# Altium project Alhambra_II.PrjPcb
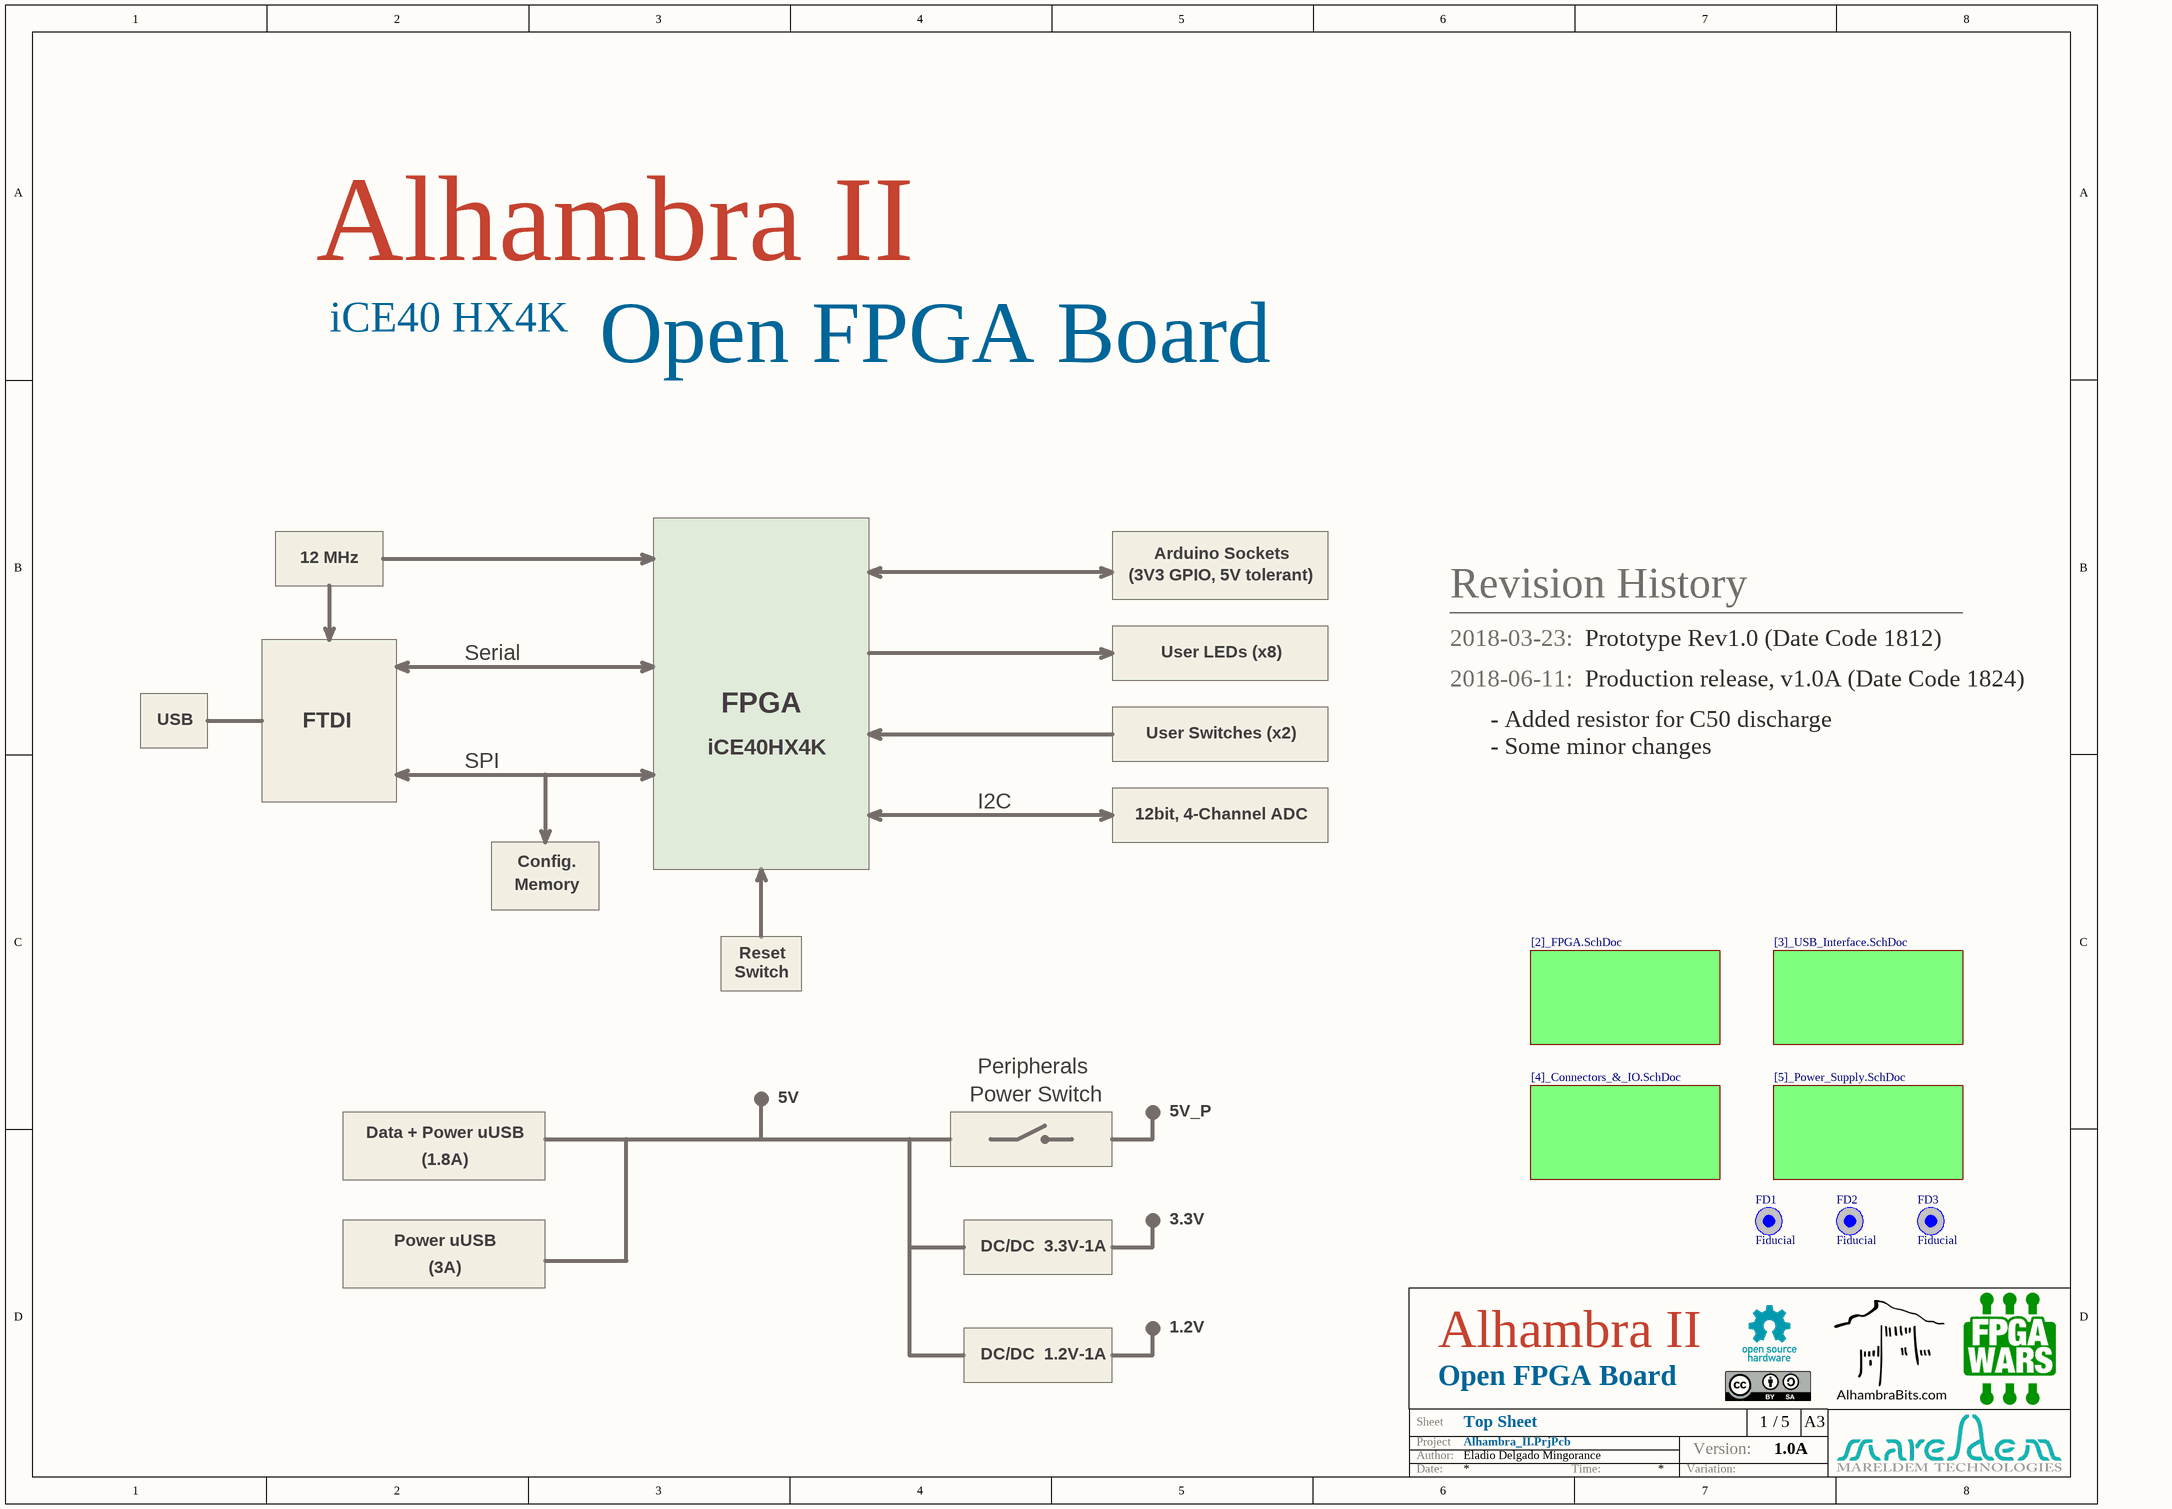
[diagram p0: [1]_Alhambra_II.SchDoc]
5 sheets, 158 parts. Net scope: flat (ports and power ports of the same name join across sheets).
Board file: Alhambra_II.PcbDoc
Sheets:
  [1]_Alhambra_II.SchDoc
    [2]_FPGA.SchDoc = [2]_FPGA.SchDoc
    [3]_USB_Interface.SchDoc = [3]_USB_Interface.SchDoc
    [4]_Connectors_&_IO.SchDoc = [4]_Connectors_&_IO.SchDoc
    [5]_Power_Supply.SchDoc = [5]_Power_Supply.SchDoc

## Sheet [1]_Alhambra_II.SchDoc: Top Sheet
size A3; Author: Eladio Delgado Mingorance; CompanyName: Mareldem Technologies; Organization: Mareldem Technologies; Revision: 1.0A; SheetNumber: 1; SheetTotal: 5

### Parts
FD1  Fiducial  [Fiducial_1mm]  (no BOM)
FD2  Fiducial  [Fiducial_1mm]  (no BOM)
FD3  Fiducial  [Fiducial_1mm]  (no BOM)

### Sub-sheets
[2]_FPGA.SchDoc = [2]_FPGA.SchDoc: no entries
[3]_USB_Interface.SchDoc = [3]_USB_Interface.SchDoc: no entries
[4]_Connectors_&_IO.SchDoc = [4]_Connectors_&_IO.SchDoc: no entries
[5]_Power_Supply.SchDoc = [5]_Power_Supply.SchDoc: no entries

### Notes on the sheet
- Alhambra II
- iCE40 HX4K
- Open FPGA Board
- 12 MHz
- (3V3 GPIO, 5V tolerant)
- Arduino Sockets
- Revision History
- 2018-03-23:
- Prototype Rev1.0 (Date Code 1812)
- Serial
- FPGA
- User LEDs (x8)
- 2018-06-11:
- Production release, v1.0A (Date Code 1824)
- USB
- FTDI
- SPI
- iCE40HX4K
- User Switches (x2)
- - Added resistor for C50 discharge
- - Some minor changes
- I2C
- 12bit, 4-Channel ADC
- Memory
- Config.
- Switch
- Reset
- 5V
- Power Switch
- Peripherals
- 5V_P
- Data + Power uUSB
- (1.8A)
- Power uUSB
- DC/DC  3.3V-1A
- 3.3V
- (3A)
- DC/DC  1.2V-1A
- 1.2V
- Project
- Sheet
- Author:
- Version:
- /
- A3
- Date:
- Time:
- Variation:

### Library data of the parts
FD1-FD3 = Fiducial 1mm: Fiducial Mark; Part Number: Fiducial 1mm

## Sheet [2]_FPGA.SchDoc: FPGA
size A3; Author: Eladio Delgado Mingorance; CompanyName: Mareldem Technologies; Organization: Mareldem Technologies; Revision: 1.0A; SheetNumber: 2; SheetTotal: 5
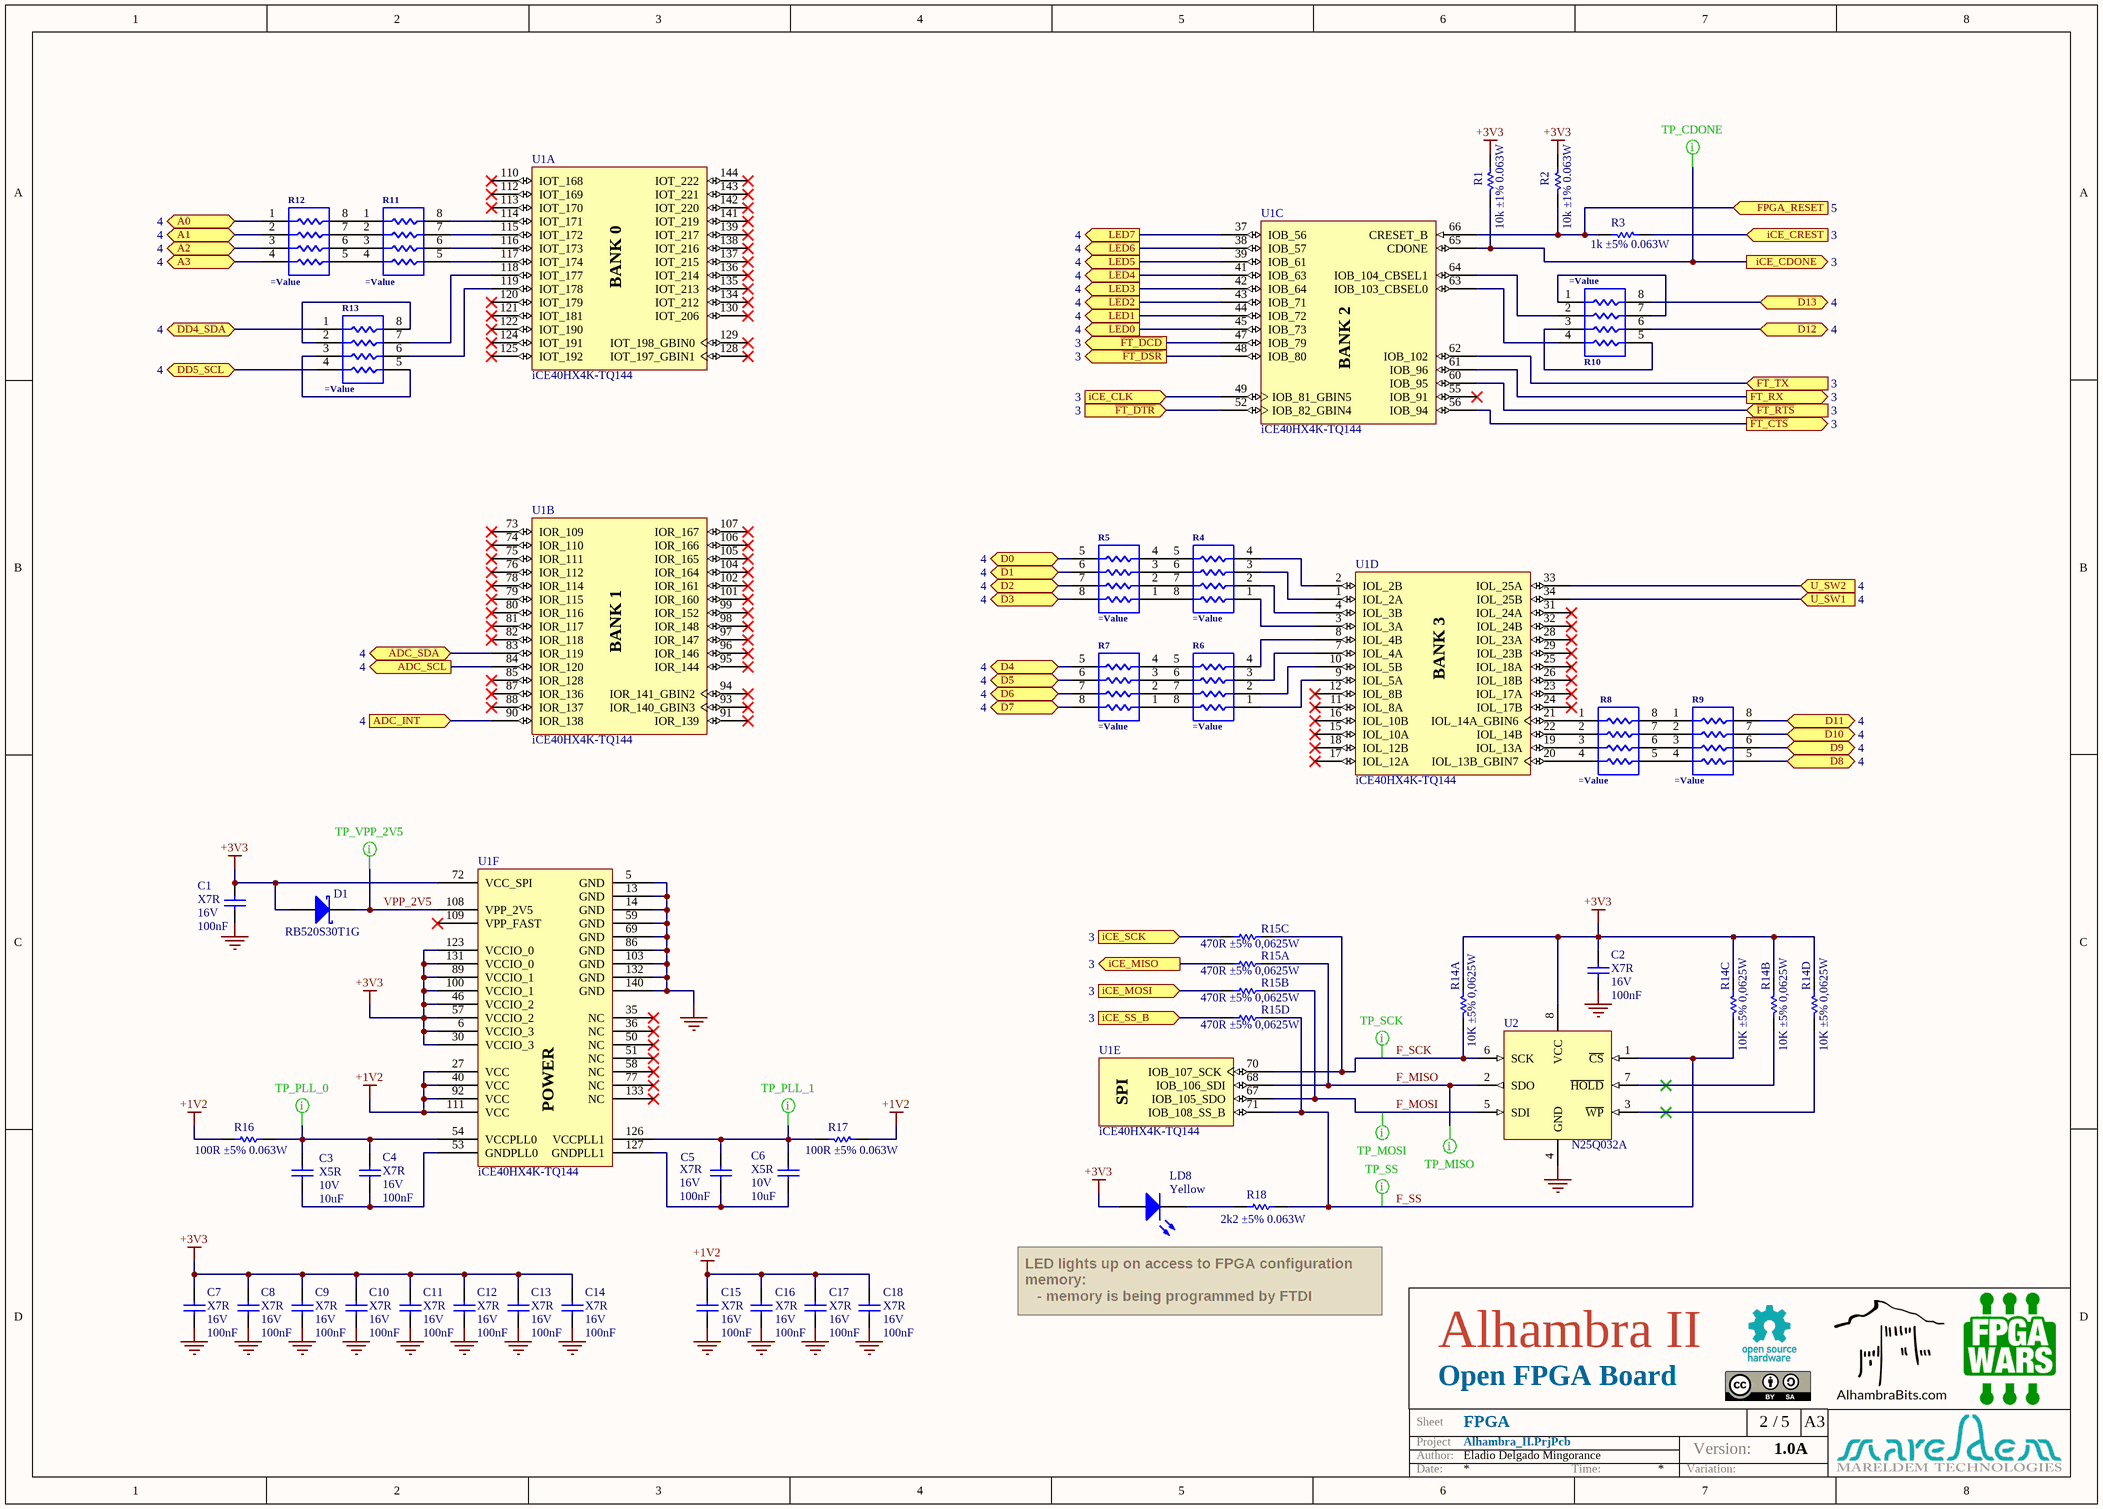
[diagram p1: [2]_FPGA.SchDoc]

### Parts
C1  Dielectric: X7R  Voltage: 16V  Capacitance: 100nF  [C0402]  (hidden comment: Capacitor)
C2  Dielectric: X7R  Voltage: 16V  Capacitance: 100nF  [C0402]  (hidden comment: Capacitor)
C3  Dielectric: X5R  Voltage: 10V  Capacitance: 10uF  [C0603]  (hidden comment: Capacitor)
C4  Dielectric: X7R  Voltage: 16V  Capacitance: 100nF  [C0402]  (hidden comment: Capacitor)
C5  Dielectric: X7R  Voltage: 16V  Capacitance: 100nF  [C0402]  (hidden comment: Capacitor)
C6  Dielectric: X5R  Voltage: 10V  Capacitance: 10uF  [C0603]  (hidden comment: Capacitor)
C7  Dielectric: X7R  Voltage: 16V  Capacitance: 100nF  [C0402]  (hidden comment: Capacitor)
C8  Dielectric: X7R  Voltage: 16V  Capacitance: 100nF  [C0402]  (hidden comment: Capacitor)
C9  Dielectric: X7R  Voltage: 16V  Capacitance: 100nF  [C0402]  (hidden comment: Capacitor)
C10  Dielectric: X7R  Voltage: 16V  Capacitance: 100nF  [C0402]  (hidden comment: Capacitor)
C11  Dielectric: X7R  Voltage: 16V  Capacitance: 100nF  [C0402]  (hidden comment: Capacitor)
C12  Dielectric: X7R  Voltage: 16V  Capacitance: 100nF  [C0402]  (hidden comment: Capacitor)
C13  Dielectric: X7R  Voltage: 16V  Capacitance: 100nF  [C0402]  (hidden comment: Capacitor)
C14  Dielectric: X7R  Voltage: 16V  Capacitance: 100nF  [C0402]  (hidden comment: Capacitor)
C15  Dielectric: X7R  Voltage: 16V  Capacitance: 100nF  [C0402]  (hidden comment: Capacitor)
C16  Dielectric: X7R  Voltage: 16V  Capacitance: 100nF  [C0402]  (hidden comment: Capacitor)
C17  Dielectric: X7R  Voltage: 16V  Capacitance: 100nF  [C0402]  (hidden comment: Capacitor)
C18  Dielectric: X7R  Voltage: 16V  Capacitance: 100nF  [C0402]  (hidden comment: Capacitor)
D1  RB520S30T1G  [SOD523]
LD8  Yellow  [LED0603]
R1  value 10k ±1% 0.063W  [R0402]  (hidden comment: Resistor)
R2  value 10k ±1% 0.063W  [R0402]  (hidden comment: Resistor)
R3  value 1k ±5% 0.063W  [R0402]  (hidden comment: Resistor)
R4  (no value)  [4xArray_1206_Convex]
R5  (no value)  [4xArray_1206_Convex]
R6  (no value)  [4xArray_1206_Convex]
R7  (no value)  [4xArray_1206_Convex]
R8  (no value)  [4xArray_1206_Convex]
R9  (no value)  [4xArray_1206_Convex]
R10  (no value)  [4xArray_1206_Convex]
R11  (no value)  [4xArray_1206_Convex]
R12  (no value)  [4xArray_1206_Convex]
R13  (no value)  [4xArray_1206_Convex]
R14  value 10K ±5% 0,0625W  [4xArray_1206_Convex]  (hidden comment: Resistor_x4_Parts)  (parts A,B,C,D of 4)
R15  value 470R ±5% 0,0625W  [4xArray_1206_Convex]  (hidden comment: Resistor_x4_Parts)  (parts A,B,C,D of 4)
R16  value 100R ±5% 0.063W  [R0402]  (hidden comment: Resistor)
R17  value 100R ±5% 0.063W  [R0402]  (hidden comment: Resistor)
R18  value 2k2 ±5% 0.063W  [R0402]  (hidden comment: Resistor)
U1  iCE40HX4K-TQ144  [TQFP-144_HX4K_FPGAwars]  (parts A,B,C,D,E,F of 6)
U2  N25Q032A  [DFN-8 6x5mm]

### Ports
A0 (bidir, see 4), A1 (bidir, see 4), A2 (bidir, see 4), A3 (bidir, see 4), ADC_INT (in, see 4), ADC_SCL (out, see 4), ADC_SDA (bidir, see 4), D0 (bidir, see 4), D1 (bidir, see 4), D2 (bidir, see 4), D3 (bidir, see 4), D4 (bidir, see 4), D5 (bidir, see 4), D6 (bidir, see 4), D7 (bidir, see 4), D8 (bidir, see 4), D9 (bidir, see 4), D10 (bidir, see 4), D11 (bidir, see 4), D12 (bidir, see 4), D13 (bidir, see 4), DD4_SDA (bidir, see 4), DD5_SCL (bidir, see 4), FPGA_RESET (in, see 5), FT_RX (out, see 3), FT_TX (in, see 3), iCE_CDONE (out, see 3), iCE_CLK (in, see 3), iCE_CREST (in, see 3), iCE_MISO (out, see 3), iCE_MOSI (in, see 3), iCE_SCK (in, see 3), iCE_SS_B (in, see 3), LED0 (out, see 4), LED1 (out, see 4), LED2 (out, see 4), LED3 (out, see 4), LED4 (out, see 4), LED5 (out, see 4), LED6 (out, see 4), LED7 (out, see 4), U_SW1 (in, see 4), U_SW2 (in, see 4), ~{FT_CTS} (out, see 3), ~{FT_DCD} (out, see 3), ~{FT_DSR} (out, see 3), ~{FT_DTR} (in, see 3), ~{FT_RTS} (in, see 3)

### Nets
+1V2: C15.2 C16.2 C17.2 C18.2 R16.2 R17.2 U1.27(VCC) U1.40(VCC) U1.92(VCC) U1.111(VCC)
+3V3: C1.2 C2.1 C7.2 C8.2 C9.2 C10.2 C11.2 C12.2 C13.2 C14.2 D1.A LD8.A R1.1 R2.1 R14.1 R14.2 R14.3 R14.4 U1.6(VCCIO_3) U1.30(VCCIO_3) U1.46(VCCIO_2) U1.57(VCCIO_2) U1.72(VCC_SPI) U1.89(VCCIO_1) U1.100(VCCIO_1) U1.123(VCCIO_0) U1.131(VCCIO_0) U2.8(VCC)
GND: C1.1 C2.2 C7.1 C8.1 C9.1 C10.1 C11.1 C12.1 C13.1 C14.1 C15.1 C16.1 C17.1 C18.1 U1.5(GND) U1.13(GND) U1.14(GND) U1.59(GND) U1.69(GND) U1.86(GND) U1.103(GND) U1.132(GND) U1.140(GND) U2.4(GND)
A0: R12.1 ; port A0
A1: R12.2 ; port A1
A2: R12.3 ; port A2
A3: R12.4 ; port A3
D0: R5.5 ; port D0
D1: R5.6 ; port D1
D2: R5.7 ; port D2
D3: R5.8 ; port D3
D4: R7.5 ; port D4
D5: R7.6 ; port D5
D6: R7.7 ; port D6
D7: R7.8 ; port D7
D8: R9.5 ; port D8
D9: R9.6 ; port D9
D10: R9.7 ; port D10
D11: R9.8 ; port D11
D12: R10.6 ; port D12
D13: R10.8 ; port D13
DD4_SDA: R13.1 ; port DD4_SDA
DD5_SCL: R13.4 ; port DD5_SCL
F_MISO: R15.8 U1.68(IOB_106_SDI) U2.2(SDO)
F_MOSI: R15.7 U1.67(IOB_105_SDO) U2.5(SDI)
F_SCK: R14.8 R15.6 U1.70(IOB_107_SCK) U2.6(SCK)
F_SS: R14.6 R15.5 R18.2 U1.71(IOB_108_SS_B) U2.1(~{CS})
VPP_2V5: D1.k(K) U1.108(VPP_2V5)
NetC3_1: C3.1 C4.2 R16.1 U1.54(VCCPLL0)
NetC3_2: C3.2 C4.1 U1.53(GNDPLL0)
NetC5_1: C5.1 C6.1 U1.127(GNDPLL1)
NetC5_2: C5.2 C6.2 R17.1 U1.126(VCCPLL1)
NetC38_2: U1.34(IOL_25B) ; port U_SW1
NetC39_2: U1.33(IOL_25A) ; port U_SW2
NetD5_A: R2.2 R3.2 U1.66(CRESET_B) ; port FPGA_RESET
NetLD8_K: LD8.K R18.1
NetR1_2: R1.2 U1.65(CDONE) ; port iCE_CDONE
NetR3_1: R3.1 ; port iCE_CREST
NetR4_1: R4.1 U1.3(IOL_3A)
NetR4_2: R4.2 U1.4(IOL_3B)
NetR4_3: R4.3 U1.1(IOL_2A)
NetR4_4: R4.4 U1.2(IOL_2B)
NetR4_5: R4.5 R5.4
NetR4_6: R4.6 R5.3
NetR4_7: R4.7 R5.2
NetR4_8: R4.8 R5.1
NetR6_1: R6.1 U1.9(IOL_5A)
NetR6_2: R6.2 U1.10(IOL_5B)
NetR6_3: R6.3 U1.7(IOL_4A)
NetR6_4: R6.4 U1.8(IOL_4B)
NetR6_5: R6.5 R7.4
NetR6_6: R6.6 R7.3
NetR6_7: R6.7 R7.2
NetR6_8: R6.8 R7.1
NetR8_1: R8.1 U1.21(IOL_14A_GBIN6)
NetR8_2: R8.2 U1.22(IOL_14B)
NetR8_3: R8.3 U1.19(IOL_13A)
NetR8_4: R8.4 U1.20(IOL_13B_GBIN7)
NetR8_5: R8.5 R9.4
NetR8_6: R8.6 R9.3
NetR8_7: R8.7 R9.2
NetR8_8: R8.8 R9.1
NetR10_1: R10.1 R10.7
NetR10_2: R10.2 U1.64(IOB_104_CBSEL1)
NetR10_3: R10.3 R10.5
NetR10_4: R10.4 U1.63(IOB_103_CBSEL0)
NetR11_1: R11.1 R12.8
NetR11_2: R11.2 R12.7
NetR11_3: R11.3 R12.6
NetR11_4: R11.4 R12.5
NetR11_5: R11.5 U1.117(IOT_174)
NetR11_6: R11.6 U1.116(IOT_173)
NetR11_7: R11.7 U1.115(IOT_172)
NetR11_8: R11.8 U1.114(IOT_171)
NetR13_2: R13.2 R13.8
NetR13_3: R13.3 R13.5
NetR13_6: R13.6 U1.119(IOT_178)
NetR13_7: R13.7 U1.118(IOT_177)
NetR14_5: R14.5 U2.3(~{WP})
NetR14_7: R14.7 U2.7(~{HOLD})
NetR15_1: R15.1 ; port iCE_MISO
NetR15_2: R15.2 ; port iCE_MOSI
NetR15_3: R15.3 ; port iCE_SCK
NetR15_4: R15.4 ; port iCE_SS_B
NetR27_2: U1.49(IOB_81_GBIN5) ; port iCE_CLK
NetR28_1: U1.84(IOR_120) ; port ADC_SCL
NetR29_1: U1.83(IOR_119) ; port ADC_SDA
NetR34_1: U1.41(IOB_63) ; port LED4
NetR34_2: U1.39(IOB_61) ; port LED5
NetR34_3: U1.38(IOB_57) ; port LED6
NetR34_4: U1.37(IOB_56) ; port LED7
NetR35_1: U1.45(IOB_73) ; port LED0
NetR35_2: U1.44(IOB_72) ; port LED1
NetR35_3: U1.43(IOB_71) ; port LED2
NetR35_4: U1.42(IOB_64) ; port LED3
NetU1_47: U1.47(IOB_79) ; port ~{FT_DCD}
NetU1_48: U1.48(IOB_80) ; port ~{FT_DSR}
NetU1_52: U1.52(IOB_82_GBIN4) ; port ~{FT_DTR}
NetU1_56: U1.56(IOB_94) ; port ~{FT_CTS}
NetU1_60: U1.60(IOB_95) ; port ~{FT_RTS}
NetU1_61: U1.61(IOB_96) ; port FT_RX
NetU1_62: U1.62(IOB_102) ; port FT_TX
NetU1_90: U1.90(IOR_138) ; port ADC_INT

Not connected (* = marked no-connect by the designer): U1 11(IOL_8A)* 12(IOL_8B)* 15(IOL_10A)* 16(IOL_10B)* 17(IOL_12A)* 18(IOL_12B)* 23(IOL_17A)* 24(IOL_17B)* 25(IOL_18A)* 26(IOL_18B)* 28(IOL_23A)* 29(IOL_23B)* 31(IOL_24A)* 32(IOL_24B)* 35(NC)* 36(NC)* 50(NC)* 51(NC)* 55(IOB_91)* 58(NC)* 73(IOR_109)* 74(IOR_110)* 75(IOR_111)* 76(IOR_112)* 77(NC)* 78(IOR_114)* 79(IOR_115)* 80(IOR_116)* 81(IOR_117)* 82(IOR_118)* 85(IOR_128)* 87(IOR_136)* 88(IOR_137)* 91(IOR_139)* 93(IOR_140_GBIN3)* 94(IOR_141_GBIN2)* 95(IOR_144)* 96(IOR_146)* 97(IOR_147)* 98(IOR_148)* 99(IOR_152)* 101(IOR_160)* 102(IOR_161)* 104(IOR_164)* 105(IOR_165)* 106(IOR_166)* 107(IOR_167)* 109(VPP_FAST)* 110(IOT_168)* 112(IOT_169)* 113(IOT_170)* 120(IOT_179)* 121(IOT_181)* 122(IOT_190)* 124(IOT_191)* 125(IOT_192)* 128(IOT_197_GBIN1)* 129(IOT_198_GBIN0)* 130(IOT_206)* 133(NC)* 134(IOT_212)* 135(IOT_213)* 136(IOT_214)* 137(IOT_215)* 138(IOT_216)* 139(IOT_217)* 141(IOT_219)* 142(IOT_220)* 143(IOT_221)* 144(IOT_222)*

### Layout directives
net class Test Points: F_MISO, F_MOSI, F_SCK, F_SS, NetC3_1, NetC5_2, NetR1_2, VPP_2V5

### Notes on the sheet
- LED lights up on access to FPGA configuration memory:
  - memory is being programmed by FTDI
  - memory is being read by FPGA after reset or power-on
- Alhambra II
- Open FPGA Board
- Project
- Sheet
- Author:
- Version:
- /
- A3
- Date:
- Time:
- Variation:
- (in symbol iCE40-HX4K, part A) BANK 0
- (in symbol iCE40-HX4K, part B) BANK 1
- (in symbol iCE40-HX4K, part C) BANK 2
- (in symbol iCE40-HX4K, part D) BANK 3
- (in symbol iCE40-HX4K, part E) SPI
- (in symbol iCE40-HX4K, part F) POWER

### Library data of the parts
C1 C2 C4 C5 C7-C18 = C0402_100nF_16V_±10%: Capacitor SMD; Manufacturer: Kemet; Value: 100nF ±10% 16V; Tolerance: ±10%; OrderingCode: C0402C104K4RAC; Temp_ Max: 125; Temp_ Min: -55; Part Number: C0402_100nF_16V_±10%; Price (€): 0,05
C3 C6 = C0603_10uF_10V_±10%: Capacitor SMD; Manufacturer: Murata; Value: 10uF ±10% 10V; Tolerance: ±10%; OrderingCode: GRM188R61A106KE69D; Temp_ Max: 85; Temp_ Min: -55; Part Number: C0603_10uF_10V_±10%; Price (€): 0,027
D1 = RB520S30T1G: Schottky Diode; Manufacturer: On Semiconductor; Ifor: 200mA; Vrrm: 30V; Ifsm: 300mA; Vf: 0,35V; Temp_ Max: 150; Temp_ Min: -55; Value: 200mA 30V; Part Number: RB520S30T1G; OrderingCode: RB520S30T1G; Price (€): 0,017
LD8 = LED Yellow 0603 Wurth: LED; Manufacturer: WE; OrderingCode: 150 060 YS7 5000; Temp_ Max: 85; Temp_ Min: -40; Part Number: LED Yellow 0603 Wurth; Price (€): 0,07; Value: Yellow
R1 R2 = R0402_10k_0.063W_±1%: Resistor, SMD; Manufacturer: Vishay; Tolerance: ±1%; OrderingCode: CRCW040210K0FK; Power: 0.063W; Resistance: 10k; Temp_ Max: 155; Temp_ Min: -55; PackageDescription: SMD; Part Number: R0402_10k_0.063W_±1%; Price (€): 0,006
R3 = R0402_1k_0.063W_±5%: Resistor, SMD; Manufacturer: Vishay; Tolerance: ±5%; OrderingCode: CRCW04021K00JN; Power: 0.063W; Resistance: 1k; Temp_ Max: 155; Temp_ Min: -55; PackageDescription: SMD; Part Number: R0402_1k_0.063W_±5%; Price (€): 0,003
R4-R13 = 4xArray_1206_Convex_100R_0,0625W_0,05: Resistor, Array 4x1; Manufacturer: Yageo; Resistance: 100R; Tolerance: 5%; OrderingCode: YC164-JR-07100RL; Temp_ Max: 155; Temp_ Min: -25; Value: 100R 5% 0,0625W; Part Number: 4xArray_1206_Convex_100R_0,0625W_0,05; Power: 0,0625W; Price (€): 0,005
R14 = 4xArray_1206_Convex_10K_0,0625W_±5%: Resistor; Manufacturer: Yageo; Tolerance: ±5%; OrderingCode: YC164-JR-0710KL; Resistance: 10K; Temp_ Max: 155; Temp_ Min: -55; PackageDescription: SMD; Power: 0,0625W; Part Number: 4xArray_1206_Convex_10K_0,0625W_±5%; Price (€): 0,006
R15 = 4xArray_1206_Convex_470R_0,0625W_±5%: Resistor; Manufacturer: Yageo; Tolerance: ±5%; OrderingCode: YC164-JR-07470RL; Resistance: 470R; Temp_ Max: 155; Temp_ Min: -25; PackageDescription: SMD; Power: 0,0625W; Part Number: 4xArray_1206_Convex_470R_0,0625W_±5%; Price (€): 0,006
R16 R17 = R0402_100R_0.063W_±5%: Resistor, SMD; Manufacturer: Vishay; Tolerance: ±5%; OrderingCode: CRCW0402100RJN; Power: 0.063W; Resistance: 100R; Temp_ Max: 155; Temp_ Min: -55; PackageDescription: SMD; Part Number: R0402_100R_0.063W_±5%; Price (€): 0,003
R18 = R0402_2k2_0.063W_±5%: Resistor, SMD; Manufacturer: Vishay; Tolerance: ±5%; OrderingCode: CRCW04022K20JN; Power: 0.063W; Resistance: 2k2; Temp_ Max: 155; Temp_ Min: -55; PackageDescription: SMD; Part Number: R0402_2k2_0.063W_±5%; Price (€): 0,003
U1 = iCE40-HX4K: iCE40 HX4K Series FPGA Family, 3520 Logic Cells, 1.2 V Core, 80 K Embedded RAM Bits, 144-pin TQFP, Pb-Free, Tray; Manufacturer: Lattice; Temp_ Max: 85; Temp_ Min: -40; Part Number: iCE40-HX4K; OrderingCode: iCE40HX4K-TQ144; Price (€): 6
U2 = N25Q032A: NOR Flash Memory, serial; Manufacturer: Micron; OrderingCode: N25Q032A13EF640E; Temp_ Max: 85; Temp_ Min: -40; OrderingCode 2: S25FL032P0XNFI011; Value: 32Mb; Part Number: N25Q032A; Supplier: Silica; Price (€): 0,9; Manufacturer 2: Spansion

## Sheet [3]_USB_Interface.SchDoc: USB Interface
size A3; Author: Eladio Delgado Mingorance; CompanyName: Mareldem Technologies; Organization: Mareldem Technologies; Revision: 1.0A; SheetNumber: 3; SheetTotal: 5
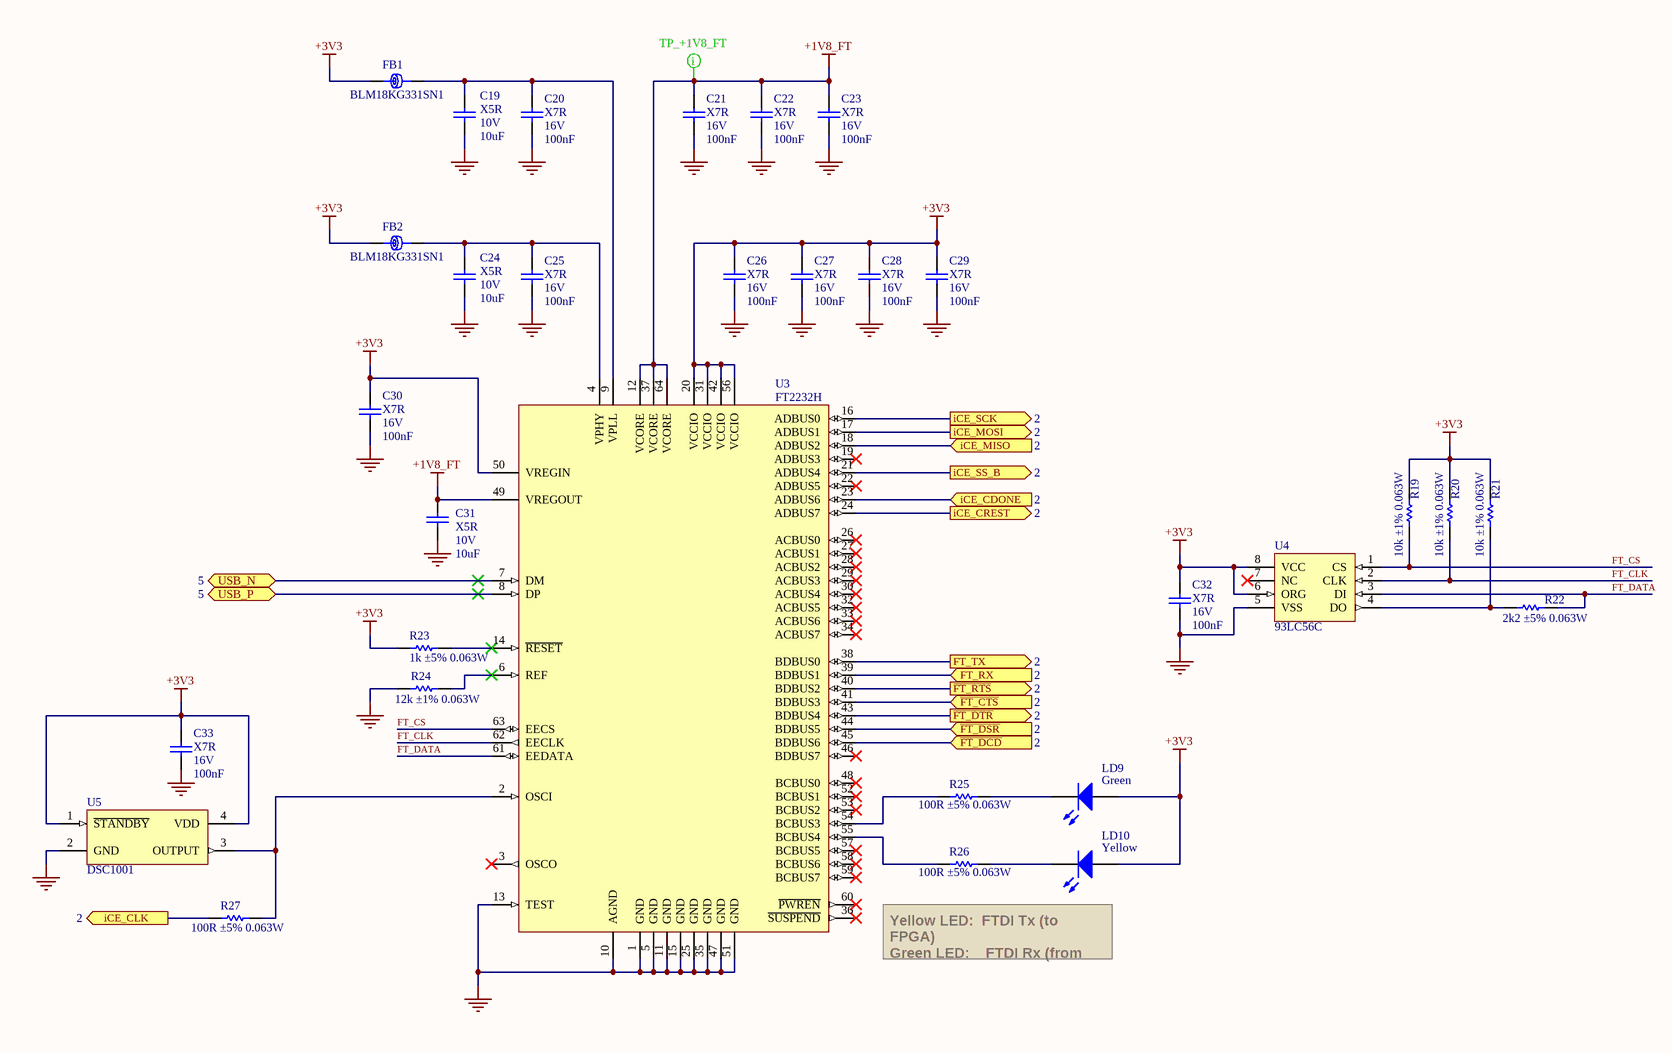
[diagram p2: [3]_USB_Interface.SchDoc]

### Parts
C19  Dielectric: X5R  Voltage: 10V  Capacitance: 10uF  [C0603]  (hidden comment: Capacitor)
C20  Dielectric: X7R  Voltage: 16V  Capacitance: 100nF  [C0402]  (hidden comment: Capacitor)
C21  Dielectric: X7R  Voltage: 16V  Capacitance: 100nF  [C0402]  (hidden comment: Capacitor)
C22  Dielectric: X7R  Voltage: 16V  Capacitance: 100nF  [C0402]  (hidden comment: Capacitor)
C23  Dielectric: X7R  Voltage: 16V  Capacitance: 100nF  [C0402]  (hidden comment: Capacitor)
C24  Dielectric: X5R  Voltage: 10V  Capacitance: 10uF  [C0603]  (hidden comment: Capacitor)
C25  Dielectric: X7R  Voltage: 16V  Capacitance: 100nF  [C0402]  (hidden comment: Capacitor)
C26  Dielectric: X7R  Voltage: 16V  Capacitance: 100nF  [C0402]  (hidden comment: Capacitor)
C27  Dielectric: X7R  Voltage: 16V  Capacitance: 100nF  [C0402]  (hidden comment: Capacitor)
C28  Dielectric: X7R  Voltage: 16V  Capacitance: 100nF  [C0402]  (hidden comment: Capacitor)
C29  Dielectric: X7R  Voltage: 16V  Capacitance: 100nF  [C0402]  (hidden comment: Capacitor)
C30  Dielectric: X7R  Voltage: 16V  Capacitance: 100nF  [C0402]  (hidden comment: Capacitor)
C31  Dielectric: X5R  Voltage: 10V  Capacitance: 10uF  [C0603]  (hidden comment: Capacitor)
C32  Dielectric: X7R  Voltage: 16V  Capacitance: 100nF  [C0402]  (hidden comment: Capacitor)
C33  Dielectric: X7R  Voltage: 16V  Capacitance: 100nF  [C0402]  (hidden comment: Capacitor)
FB1  BLM18KG331SN1  [L0603]
FB2  BLM18KG331SN1  [L0603]
LD9  Green  [LED0603]
LD10  Yellow  [LED0603]
R19  value 10k ±1% 0.063W  [R0402]  (hidden comment: Resistor)
R20  value 10k ±1% 0.063W  [R0402]  (hidden comment: Resistor)
R21  value 10k ±1% 0.063W  [R0402]  (hidden comment: Resistor)
R22  value 2k2 ±5% 0.063W  [R0402]  (hidden comment: Resistor)
R23  value 1k ±5% 0.063W  [R0402]  (hidden comment: Resistor)
R24  value 12k ±1% 0.063W  [R0402]  (hidden comment: Resistor)
R25  value 100R ±5% 0.063W  [R0402]  (hidden comment: Resistor)
R26  value 100R ±5% 0.063W  [R0402]  (hidden comment: Resistor)
R27  value 100R ±5% 0.063W  [R0402]  (hidden comment: Resistor)
U3  FT2232H  [FTDI_QFN-64]
U4  93LC56C  [MSOP8]
U5  DSC1001  [OSC 3.2x2.5]

### Ports
FT_RX (in, see 2), FT_TX (out, see 2), iCE_CDONE (in, see 2), iCE_CLK (out, see 2), iCE_CREST (out, see 2), iCE_MISO (in, see 2), iCE_MOSI (out, see 2), iCE_SCK (out, see 2), iCE_SS_B (out, see 2), USB_N (bidir, see 5), USB_P (bidir, see 5), ~{FT_CTS} (in, see 2), ~{FT_DCD} (in, see 2), ~{FT_DSR} (in, see 2), ~{FT_DTR} (out, see 2), ~{FT_RTS} (out, see 2)

### Nets
+1V8_FT: C21.2 C22.2 C23.2 C31.2 U3.12(VCORE) U3.37(VCORE) U3.49(VREGOUT) U3.64(VCORE)
+3V3: C26.2 C27.2 C28.2 C29.2 C30.2 C32.2 C33.2 FB1.1 FB2.1 LD9.A LD10.A R19.2 R20.2 R21.2 R23.2 U3.20(VCCIO) U3.31(VCCIO) U3.42(VCCIO) U3.50(VREGIN) U3.56(VCCIO) U4.6(ORG) U4.8(VCC) U5.1(~{STANDBY}) U5.4(VDD)
GND: C19.1 C20.1 C21.1 C22.1 C23.1 C24.1 C25.1 C26.1 C27.1 C28.1 C29.1 C30.1 C31.1 C32.1 C33.1 R24.2 U3.1(GND) U3.5(GND) U3.10(AGND) U3.11(GND) U3.13(TEST) U3.15(GND) U3.25(GND) U3.35(GND) U3.47(GND) U3.51(GND) U4.5(VSS) U5.2(GND)
FT_CLK: R20.1 U3.62(EECLK) U4.2(CLK)
FT_CS: R19.1 U3.63(EECS) U4.1(CS)
FT_DATA: R22.1 U3.61(EEDATA) U4.3(DI)
USB_N: U3.7(DM) ; port USB_N
USB_P: U3.8(DP) ; port USB_P
NetC19_2: C19.2 C20.2 FB1.2 U3.9(VPLL)
NetC24_2: C24.2 C25.2 FB2.2 U3.4(VPHY)
NetLD9_K: LD9.K R25.2
NetLD10_K: LD10.K R26.2
NetR1_2: U3.23(ADBUS6) ; port iCE_CDONE
NetR3_1: U3.24(ADBUS7) ; port iCE_CREST
NetR15_1: U3.18(ADBUS2) ; port iCE_MISO
NetR15_2: U3.17(ADBUS1) ; port iCE_MOSI
NetR15_3: U3.16(ADBUS0) ; port iCE_SCK
NetR15_4: U3.21(ADBUS4) ; port iCE_SS_B
NetR21_1: R21.1 R22.2 U4.4(DO)
NetR23_1: R23.1 U3.14(~{RESET})
NetR24_1: R24.1 U3.6(REF)
NetR25_1: R25.1 U3.54(BCBUS3)
NetR26_1: R26.1 U3.55(BCBUS4)
NetR27_1: R27.1 U3.2(OSCI) U5.3(OUTPUT)
NetR27_2: R27.2 ; port iCE_CLK
NetU1_47: U3.45(BDBUS6) ; port ~{FT_DCD}
NetU1_48: U3.44(BDBUS5) ; port ~{FT_DSR}
NetU1_52: U3.43(BDBUS4) ; port ~{FT_DTR}
NetU1_56: U3.41(BDBUS3) ; port ~{FT_CTS}
NetU1_60: U3.40(BDBUS2) ; port ~{FT_RTS}
NetU1_61: U3.39(BDBUS1) ; port FT_RX
NetU1_62: U3.38(BDBUS0) ; port FT_TX

Not connected (* = marked no-connect by the designer): U3 3(OSCO)* 19(ADBUS3)* 22(ADBUS5)* 26(ACBUS0)* 27(ACBUS1)* 28(ACBUS2)* 29(ACBUS3)* 30(ACBUS4)* 32(ACBUS5)* 33(ACBUS6)* 34(ACBUS7)* 36(~{SUSPEND})* 46(BDBUS7)* 48(BCBUS0)* 52(BCBUS1)* 53(BCBUS2)* 57(BCBUS5)* 58(BCBUS6)* 59(BCBUS7)* 60(~{PWREN})*; U4 7(NC)*

### Layout directives
net class Test Points: +1V8_FT

### Notes on the sheet
- Yellow LED:  FTDI Tx (to FPGA)
  Green LED:    FTDI Rx (from FPGA)
- Alhambra II
- Open FPGA Board
- Project
- Sheet
- Author:
- Version:
- /
- A3
- Date:
- Time:
- Variation:

### Library data of the parts
C19 C24 C31 = C0603_10uF_10V_±10%: as C3 on sheet [2]_FPGA; Part Number: C0603_10uF_10V_±10%; Price (€): 0,027
C20-C23 C25-C30 C32 C33 = C0402_100nF_16V_±10%: as C1 on sheet [2]_FPGA; Part Number: C0402_100nF_16V_±10%; Price (€): 0,05
FB1 FB2 = L0603_330R_0,080R_1700 mA: Ferrite Bead; Manufacturer: Murata; Resistance_100MHz: 330R; Resistance_DC: 0,080R; Current: 1700 mA; Temp_ Max: 125; Temp_ Min: -55; Value: 330R 0,080R 1700 mA; Part Number: L0603_330R_0,080R_1700 mA; OrderingCode: BLM18KG331SN1; Price (€): 0,021
LD9 = LED Green 0603 Wurth: LED; Manufacturer: WE; OrderingCode: 150 060 VS7 5000; Temp_ Max: 85; Temp_ Min: -40; Part Number: LED Green 0603 Wurth; Price (€): 0,07; Value: Green
LD10 = LED Yellow 0603 Wurth: as LD8 on sheet [2]_FPGA; Part Number: LED Yellow 0603 Wurth; Price (€): 0,07; Value: Yellow
R19-R21 = R0402_10k_0.063W_±1%: as R1 on sheet [2]_FPGA; PackageDescription: SMD; Part Number: R0402_10k_0.063W_±1%; Price (€): 0,006
R22 = R0402_2k2_0.063W_±5%: as R18 on sheet [2]_FPGA; PackageDescription: SMD; Part Number: R0402_2k2_0.063W_±5%; Price (€): 0,003
R23 = R0402_1k_0.063W_±5%: as R3 on sheet [2]_FPGA; PackageDescription: SMD; Part Number: R0402_1k_0.063W_±5%; Price (€): 0,003
R24 = R0402_12k_0.063W_±1%: Resistor, SMD; Manufacturer: Vishay; Tolerance: ±1%; OrderingCode: CRCW040212K0FK; Power: 0.063W; Resistance: 12k; Temp_ Max: 155; Temp_ Min: -55; PackageDescription: SMD; Part Number: R0402_12k_0.063W_±1%; Price (€): 0,006
R25-R27 = R0402_100R_0.063W_±5%: as R16 on sheet [2]_FPGA; PackageDescription: SMD; Part Number: R0402_100R_0.063W_±5%; Price (€): 0,003
U3 = FT2232H: Dual High Speed USB to Multipurpose UART/FIFO IC; Manufacturer: FTDI; OrderingCode: FT2232HQ-REEL; Temp_ Max: 85; Temp_ Min: -40; Part Number: FT2232H; Supplier: Silica; Price (€): 3,45
U4 = 93LC56C: EEPROM, 2K Microwire Compatible Serial, 8 or 16 bit word size, 2.5-5.5 Vcc range; Manufacturer: Microchip; OrderingCode: 93LC56CT-I/MS; Temp_ Max: 85; Temp_ Min: -40; Value: 2Kb; Part Number: 93LC56C; Supplier: Silica; Price (€): 0,24
U5 = DSC1001-12MHZ: Oscillator, Low-Power CMOS, 4 pin, 1.8-3.3V; Manufacturer: Microchip; OrderingCode: DSC1001CL2-012.0000; Temp_ Max: 105; Temp_ Min: -40; Value: 12MHz; Part Number: DSC1001-12MHZ; Price (€): 0,61

## Sheet [4]_Connectors_&_IO.SchDoc: Connectors & I/O
size A3; Author: Eladio Delgado Mingorance; CompanyName: Mareldem Technologies; Organization: Mareldem Technologies; Revision: 1.0A; SheetNumber: 4; SheetTotal: 5
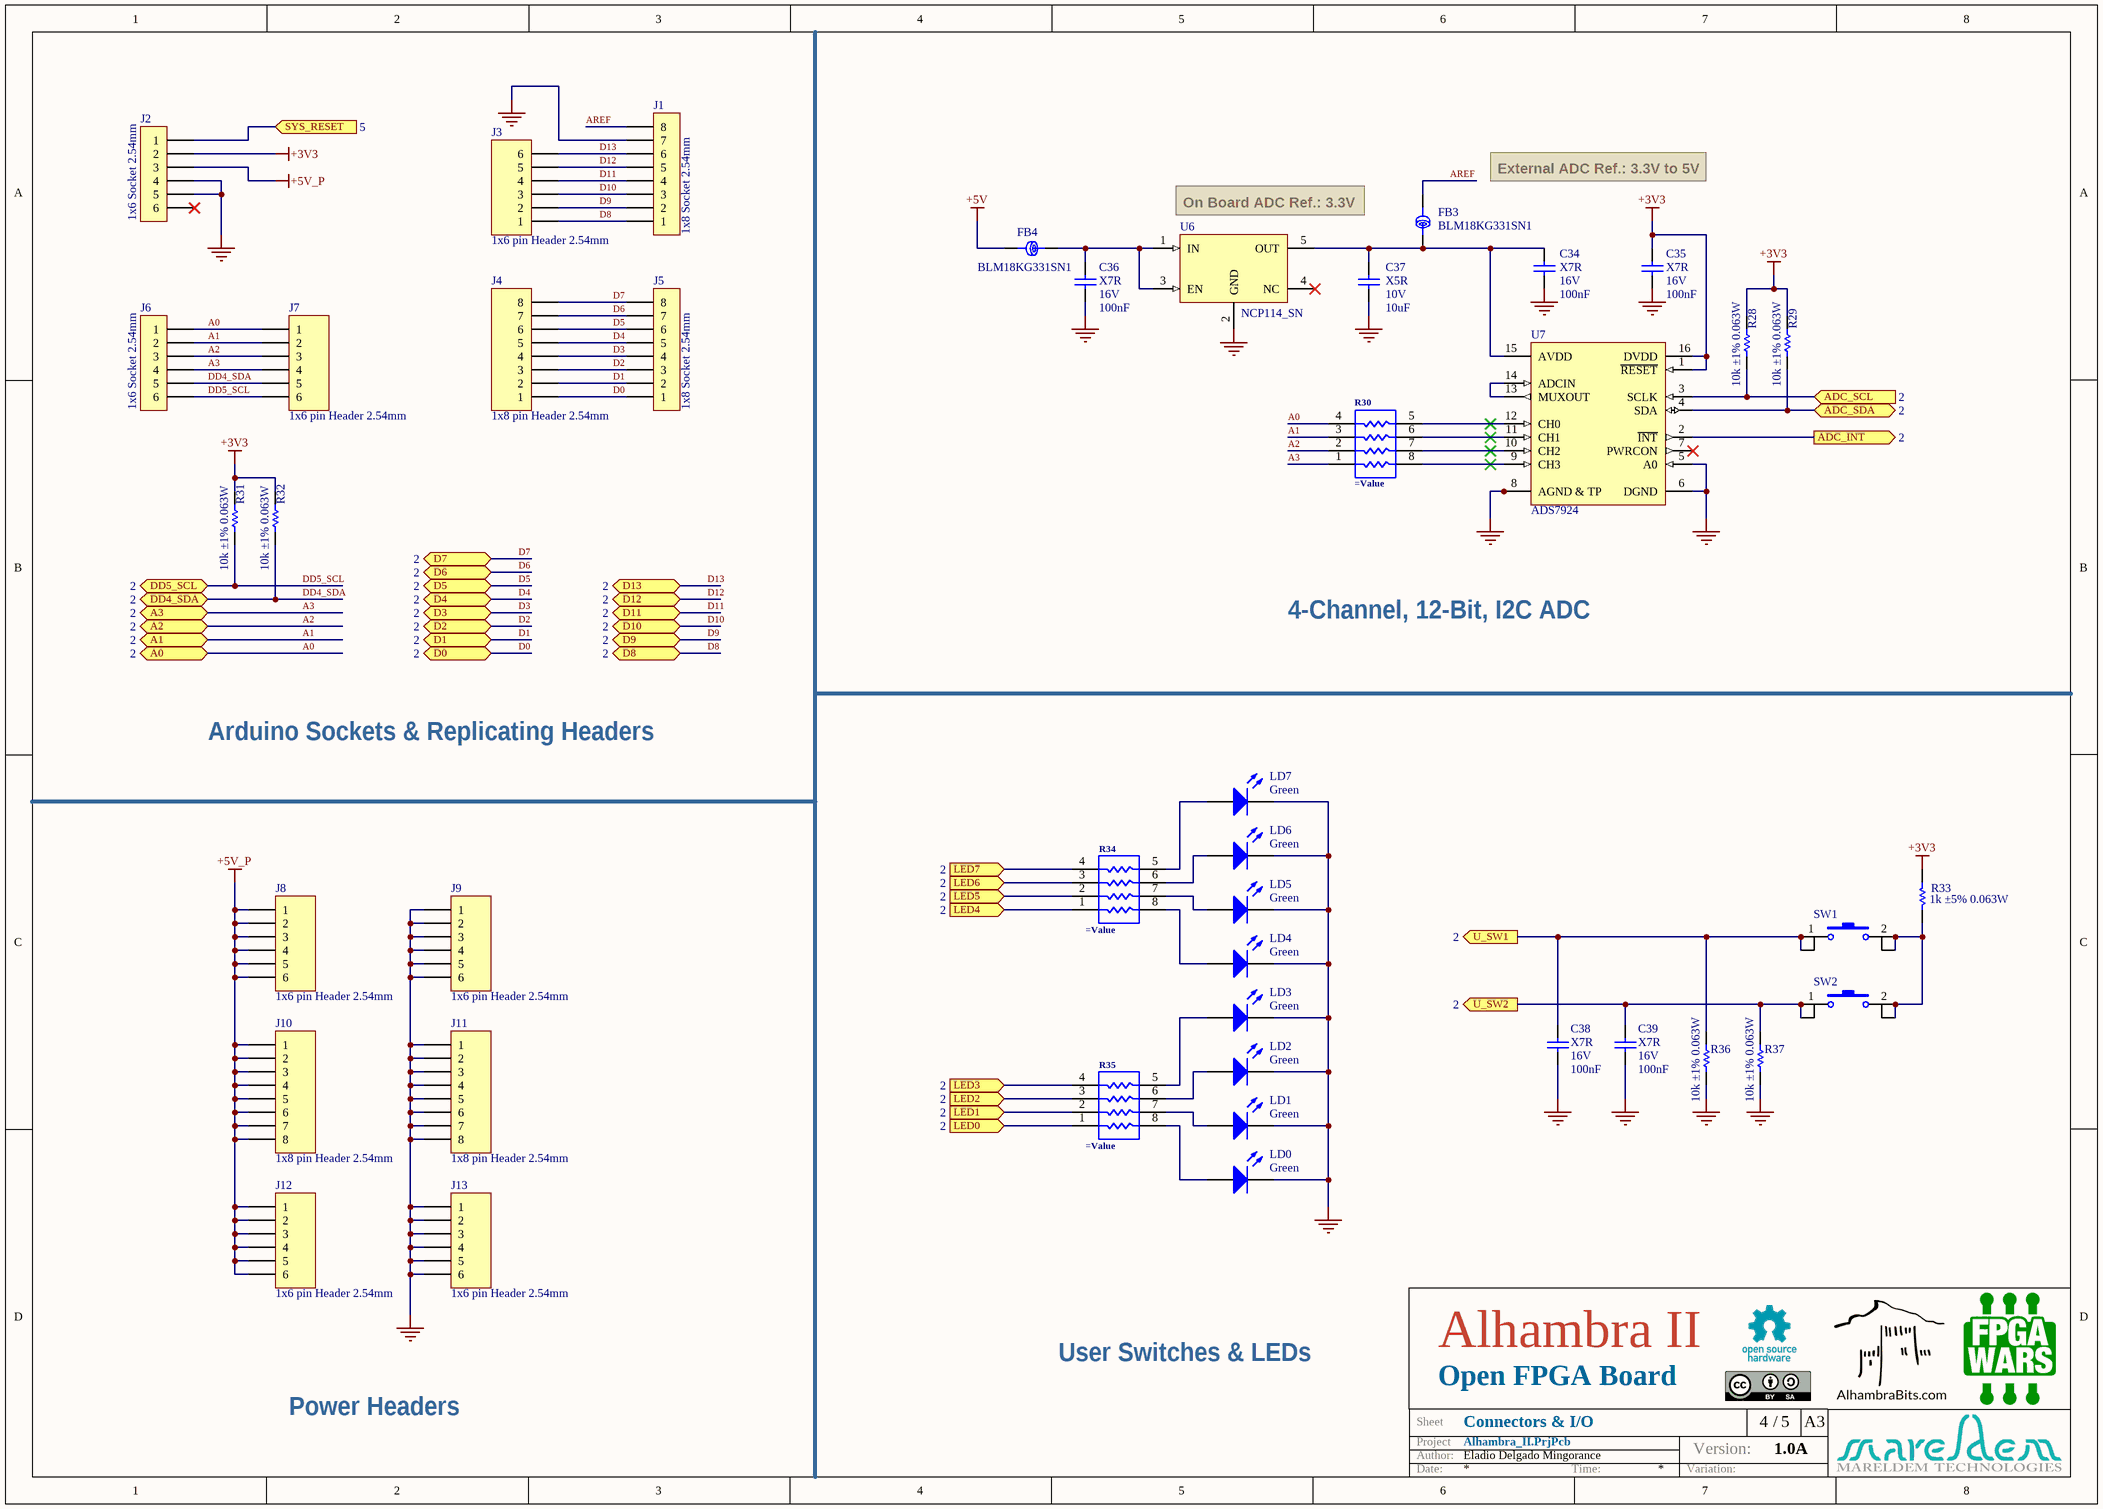
[diagram p3: [4]_Connectors_&_IO.SchDoc]

### Parts
C34  Dielectric: X7R  Voltage: 16V  Capacitance: 100nF  [C0402]  (hidden comment: Capacitor)
C35  Dielectric: X7R  Voltage: 16V  Capacitance: 100nF  [C0402]  (hidden comment: Capacitor)
C36  Dielectric: X7R  Voltage: 16V  Capacitance: 100nF  [C0402]  (hidden comment: Capacitor)
C37  Dielectric: X5R  Voltage: 10V  Capacitance: 10uF  [C0603]  (hidden comment: Capacitor)
C38  Dielectric: X7R  Voltage: 16V  Capacitance: 100nF  [C0402]  (hidden comment: Capacitor)
C39  Dielectric: X7R  Voltage: 16V  Capacitance: 100nF  [C0402]  (hidden comment: Capacitor)
FB3  BLM18KG331SN1  [L0603]
FB4  BLM18KG331SN1  [L0603]
J1  1x8 Socket 2.54mm  [1x8 Socket Header THT 2.54mm PIH]
J2  1x6 Socket 2.54mm  [1x6 Socket Header THT 2.54mm PIH]
J3  1x6 pin Header 2.54mm  [1x6 Pin Header 2.54 WHITE PIH]
J4  1x8 pin Header 2.54mm  [1x8 Pin Header 2.54 WHITE PIH]
J5  1x8 Socket 2.54mm  [1x8 Socket Header THT 2.54mm PIH]
J6  1x6 Socket 2.54mm  [1x6 Socket Header THT 2.54mm PIH]
J7  1x6 pin Header 2.54mm  [1x6 Pin Header 2.54 WHITE PIH]
J8  1x6 pin Header 2.54mm  [1x6 Pin Header 2.54 RED PIH]
J9  1x6 pin Header 2.54mm  [1x6 Pin Header 2.54 BLACK PIH]
J10  1x8 pin Header 2.54mm  [1x8 Pin Header 2.54 RED PIH]
J11  1x8 pin Header 2.54mm  [1x8 Pin Header 2.54 BLACK PIH]
J12  1x6 pin Header 2.54mm  [1x6 Pin Header 2.54 RED PIH]
J13  1x6 pin Header 2.54mm  [1x6 Pin Header 2.54 BLACK PIH]
LD0  Green  [LED0603]
LD1  Green  [LED0603]
LD2  Green  [LED0603]
LD3  Green  [LED0603]
LD4  Green  [LED0603]
LD5  Green  [LED0603]
LD6  Green  [LED0603]
LD7  Green  [LED0603]
R28  value 10k ±1% 0.063W  [R0402]  (hidden comment: Resistor)
R29  value 10k ±1% 0.063W  [R0402]  (hidden comment: Resistor)
R30  (no value)  [4xArray_1206_Convex]
R31  value 10k ±1% 0.063W  [R0402]  (hidden comment: Resistor)
R32  value 10k ±1% 0.063W  [R0402]  (hidden comment: Resistor)
R33  value 1k ±5% 0.063W  [R0402]  (hidden comment: Resistor)
R34  (no value)  [4xArray_1206_Convex]
R35  (no value)  [4xArray_1206_Convex]
R36  value 10k ±1% 0.063W  [R0402]  (hidden comment: Resistor)
R37  value 10k ±1% 0.063W  [R0402]  (hidden comment: Resistor)
SW1  Switch_4P_SP_1-3_4-2  [4363x30458xx]  (value not drawn)
SW2  Switch_4P_SP_1-3_4-2  [4363x30458xx]  (value not drawn)
U6  NCP114_SN  [SOT23-5_M]
U7  ADS7924  [QFN16]

### Ports
A0 (bidir, see 2), A1 (bidir, see 2), A2 (bidir, see 2), A3 (bidir, see 2), ADC_INT (out, see 2), ADC_SCL (in, see 2), ADC_SDA (bidir, see 2), D0 (bidir, see 2), D1 (bidir, see 2), D2 (bidir, see 2), D3 (bidir, see 2), D4 (bidir, see 2), D5 (bidir, see 2), D6 (bidir, see 2), D7 (bidir, see 2), D8 (bidir, see 2), D9 (bidir, see 2), D10 (bidir, see 2), D11 (bidir, see 2), D12 (bidir, see 2), D13 (bidir, see 2), DD4_SDA (bidir, see 2), DD5_SCL (bidir, see 2), LED0 (in, see 2), LED1 (in, see 2), LED2 (in, see 2), LED3 (in, see 2), LED4 (in, see 2), LED5 (in, see 2), LED6 (in, see 2), LED7 (in, see 2), SYS_RESET (in, see 5), U_SW1 (out, see 2), U_SW2 (out, see 2)

### Nets
+3V3: C35.2 J2.2 R28.2 R29.2 R31.2 R32.2 R33.1 U7.1(~{RESET}) U7.16(DVDD)
+5V: FB4.2
+5V_P: J2.3 J8.1 J8.2 J8.3 J8.4 J8.5 J8.6 J10.1 J10.2 J10.3 J10.4 J10.5 J10.6 J10.7 J10.8 J12.1 J12.2 J12.3 J12.4 J12.5 J12.6
GND: C34.2 C35.1 C36.1 C37.2 C38.1 C39.1 J1.7 J2.4 J2.5 J9.1 J9.2 J9.3 J9.4 J9.5 J9.6 J11.1 J11.2 J11.3 J11.4 J11.5 J11.6 J11.7 J11.8 J13.1 J13.2 J13.3 J13.4 J13.5 J13.6 LD0.K LD1.K LD2.K LD3.K LD4.K LD5.K LD6.K LD7.K R36.1 R37.1 U6.2(GND) U7.0(TP) U7.5(A0) U7.6(DGND) U7.8(AGND_&_TP)
A0: J6.1 J7.1 R30.4 ; port A0
A1: J6.2 J7.2 R30.3 ; port A1
A2: J6.3 J7.3 R30.2 ; port A2
A3: J6.4 J7.4 R30.1 ; port A3
AREF: FB3.2 J1.8
D0: J4.1 J5.1 ; port D0
D1: J4.2 J5.2 ; port D1
D2: J4.3 J5.3 ; port D2
D3: J4.4 J5.4 ; port D3
D4: J4.5 J5.5 ; port D4
D5: J4.6 J5.6 ; port D5
D6: J4.7 J5.7 ; port D6
D7: J4.8 J5.8 ; port D7
D8: J1.1 J3.1 ; port D8
D9: J1.2 J3.2 ; port D9
D10: J1.3 J3.3 ; port D10
D11: J1.4 J3.4 ; port D11
D12: J1.5 J3.5 ; port D12
D13: J1.6 J3.6 ; port D13
DD4_SDA: J6.5 J7.5 R32.1 ; port DD4_SDA
DD5_SCL: J6.6 J7.6 R31.1 ; port DD5_SCL
NetC34_1: C34.1 C37.1 FB3.1 U6.5(OUT) U7.15(AVDD)
NetC36_2: C36.2 FB4.1 U6.1(IN) U6.3(EN)
NetC38_2: C38.2 R36.2 SW1.1 SW1.3 ; port U_SW1
NetC39_2: C39.2 R37.2 SW2.1 SW2.3 ; port U_SW2
NetD5_k: J2.1 ; port SYS_RESET
NetLD0_A: LD0.A R35.8
NetLD1_A: LD1.A R35.7
NetLD2_A: LD2.A R35.6
NetLD3_A: LD3.A R35.5
NetLD4_A: LD4.A R34.8
NetLD5_A: LD5.A R34.7
NetLD6_A: LD6.A R34.6
NetLD7_A: LD7.A R34.5
NetR28_1: R28.1 U7.3(SCLK) ; port ADC_SCL
NetR29_1: R29.1 U7.4(SDA) ; port ADC_SDA
NetR30_5: R30.5 U7.12(CH0)
NetR30_6: R30.6 U7.11(CH1)
NetR30_7: R30.7 U7.10(CH2)
NetR30_8: R30.8 U7.9(CH3)
NetR33_2: R33.2 SW1.2 SW1.4 SW2.2 SW2.4
NetR34_1: R34.1 ; port LED4
NetR34_2: R34.2 ; port LED5
NetR34_3: R34.3 ; port LED6
NetR34_4: R34.4 ; port LED7
NetR35_1: R35.1 ; port LED0
NetR35_2: R35.2 ; port LED1
NetR35_3: R35.3 ; port LED2
NetR35_4: R35.4 ; port LED3
NetU1_90: U7.2(~{INT}) ; port ADC_INT
NetU7_13: U7.13(MUXOUT) U7.14(ADCIN)

Not connected (* = marked no-connect by the designer): J2 6*; U6 4(NC)*; U7 7(PWRCON)*

### Notes on the sheet
- External ADC Ref.: 3.3V to 5V
- (near U6) On Board ADC Ref.: 3.3V
- 4-Channel, 12-Bit, I2C ADC
- Arduino Sockets & Replicating Headers
- User Switches & LEDs
- Power Headers
- Alhambra II
- Open FPGA Board
- Project
- Sheet
- Author:
- Version:
- /
- A3
- Date:
- Time:
- Variation:

### Library data of the parts
C34-C36 C38 C39 = C0402_100nF_16V_±10%: as C1 on sheet [2]_FPGA; Part Number: C0402_100nF_16V_±10%; Price (€): 0,05
C37 = C0603_10uF_10V_±10%: as C3 on sheet [2]_FPGA; Part Number: C0603_10uF_10V_±10%; Price (€): 0,027
FB3 FB4 = L0603_330R_0,080R_1700 mA: as FB1 on sheet [3]_USB_Interface; Part Number: L0603_330R_0,080R_1700 mA; OrderingCode: BLM18KG331SN1; Price (€): 0,021
J1 = CON_SH_THT2.54_8 PIH: Connector, 8 pin Socket Header 2.54mm; Manufacturer: Samtec; OrderingCode: SSW-108-01-T-S; Temp_ Max: 125; Temp_ Min: -40; OrderingCode 2: 613 008 118 21; Value: 8 PIH; Pitch: 2.54mm; Part Number: CON_SH_THT2.54_8 PIH; Supplier: Samtec; Price (€): 0,438; Manufacturer 2: Würth Elektronik
J2 = CON_SH_THT2.54_6 PIH: Connector, 6 pin Socket Header 2.54mm; Manufacturer: Samtec; OrderingCode: SSW-106-01-T-S; Temp_ Max: 125; Temp_ Min: -40; OrderingCode 2: 613 006 118 21; Value: 6 PIH; Pitch: 2.54mm; Part Number: CON_SH_THT2.54_6 PIH; Supplier: Samtec; Price (€): 0,381; Manufacturer 2: Würth Elektronik
J3 J7 = CON_PH_THT2.54_6 Natural PIH: Connector, 1x6 pin Header 2.54mm; Manufacturer: Samtec; OrderingCode: HTSW-106-07-T-S-NATURAL; Temp_ Max: 105; Temp_ Min: -55; Pitch: 2.54mm; Part Number: CON_PH_THT2.54_6 Natural PIH; Supplier: Samtec; Price (€): 0,26
J4 = CON_PH_THT2.54_8 Natural PIH: Connector, 1x8 pin Header 2.54mm; Manufacturer: Samtec; OrderingCode: HTSW-108-07-T-S-NATURAL; Temp_ Max: 105; Temp_ Min: -55; Pitch: 2.54mm; Part Number: CON_PH_THT2.54_8 Natural PIH; Supplier: Samtec; Price (€): 0,35
J5 = CON_SH_THT2.54_8 PIH: Connector, 8 pin Socket Header 2.54mm; Manufacturer: Samtec; OrderingCode: SSW-108-01-T-S; Temp_ Max: 125; Temp_ Min: -40; Value: 8 PIH; OrderingCode 2: 613 008 118 21; Pitch: 2.54mm; Part Number: CON_SH_THT2.54_8 PIH; Supplier: Samtec; Price (€): 0,438; Manufacturer 2: Würth Elektronik
J6 = CON_SH_THT2.54_6 PIH: Connector, 6 pin Socket Header 2.54mm; Manufacturer: Samtec; OrderingCode: SSW-106-01-T-S; Temp_ Max: 125; Temp_ Min: -40; Value: 6 PIH; OrderingCode 2: 613 006 118 21; Pitch: 2.54mm; Part Number: CON_SH_THT2.54_6 PIH; Supplier: Samtec; Price (€): 0,381; Manufacturer 2: Würth Elektronik
J8 J12 = CON_PH_THT2.54_6 Red PIH: Connector, 1x6 pin Header 2.54mm; Manufacturer: Samtec; OrderingCode: HTSW-106-07-T-S-RED; Temp_ Max: 105; Temp_ Min: -55; Pitch: 2.54mm; Part Number: CON_PH_THT2.54_6 Red PIH; Supplier: Samtec; Price (€): 0,26
J9 J13 = CON_PH_THT2.54_6 Black PIH: Connector, 1x6 pin Header 2.54mm; Manufacturer: Samtec; OrderingCode: HTSW-106-07-T-S-BLACK; Temp_ Max: 105; Temp_ Min: -55; Pitch: 2.54mm; Part Number: CON_PH_THT2.54_6 Black PIH; Supplier: Samtec; Price (€): 0,26
J10 = CON_PH_THT2.54_8 Red PIH: Connector, 1x8 pin Header 2.54mm; Manufacturer: Samtec; OrderingCode: HTSW-108-07-T-S-RED; Temp_ Max: 105; Temp_ Min: -55; Pitch: 2.54mm; Part Number: CON_PH_THT2.54_8 Red PIH; Supplier: Samtec; Price (€): 0,35
J11 = CON_PH_THT2.54_8 Black PIH: Connector, 1x8 pin Header 2.54mm; Manufacturer: Samtec; OrderingCode: HTSW-108-07-T-S-BLACK; Temp_ Max: 105; Temp_ Min: -55; Pitch: 2.54mm; Part Number: CON_PH_THT2.54_8 Black PIH; Supplier: Samtec; Price (€): 0,35
LD0-LD7 = LED Green 0603 Wurth: as LD9 on sheet [3]_USB_Interface; Part Number: LED Green 0603 Wurth; Price (€): 0,07; Value: Green
R28 R29 R31 R32 R36 R37 = R0402_10k_0.063W_±1%: as R1 on sheet [2]_FPGA; PackageDescription: SMD; Part Number: R0402_10k_0.063W_±1%; Price (€): 0,006
R30 = 4xArray_1206_Convex_100R_0,0625W_±5%: Resistor, Array 4x1; Manufacturer: Yageo; Resistance: 100R; Tolerance: ±5%; OrderingCode: YC164-JR-07100RL; Temp_ Max: 155; Temp_ Min: -55; Value: 100R ±5% 0,0625W; Part Number: 4xArray_1206_Convex_100R_0,0625W_±5%; Power: 0,0625W; Price (€): 0,006
R33 = R0402_1k_0.063W_±5%: as R3 on sheet [2]_FPGA; PackageDescription: SMD; Part Number: R0402_1k_0.063W_±5%; Price (€): 0,003
R34 R35 = 4xArray_1206_Convex_470R_0,0625W_0,05: Resistor, Array 4x1; Manufacturer: Yageo; Resistance: 470R; Tolerance: 5%; OrderingCode: YC164-JR-07470RL; Temp_ Max: 155; Temp_ Min: -25; Value: 470R 5% 0,0625W; Part Number: 4xArray_1206_Convex_470R_0,0625W_0,05; Power: 0,0625W; Price (€): 0,006
SW1 SW2 = SW 4,7x3,5 mm SMD side push: Micro miniature pushbutton surface Switch; Manufacturer: WE; OrderingCode: 436353045816; Temp_ Max: 85; Temp_ Min: -40; Part Number: SW 4,7x3,5 mm SMD side push; Supplier: WE; Price (€): 0,2
U6 = NCP114: LDO Regulator, 5pin, SOT-23; Part Number: NCP114; Manufacturer: ON Semiconductor; Voltage IN: 1,7 - 5.5V; Voltage OUT: 3,3V; Current OUT: 300 mA; OrderingCode: NCP114BSN330T1G; Temp_ Max: 85; Temp_ Min: -40; OrderingCode 2: NCP114ASN330T1G; Price (€): 0,07
U7 = ADS7924: ADC Converter, 12-Bit, 4-Ch, I2C; Manufacturer: Texas Instruments; OrderingCode: ADS7924IRTER; Temp_ Max: 85; Temp_ Min: -40; Part Number: ADS7924; Supplier: Silica; Price (€): 1,35

## Sheet [5]_Power_Supply.SchDoc: Power Supply
size A3; Author: Eladio Delgado Mingorance; CompanyName: Mareldem Technologies; Organization: Mareldem Technologies; Revision: 1.0A; SheetNumber: 5; SheetTotal: 5
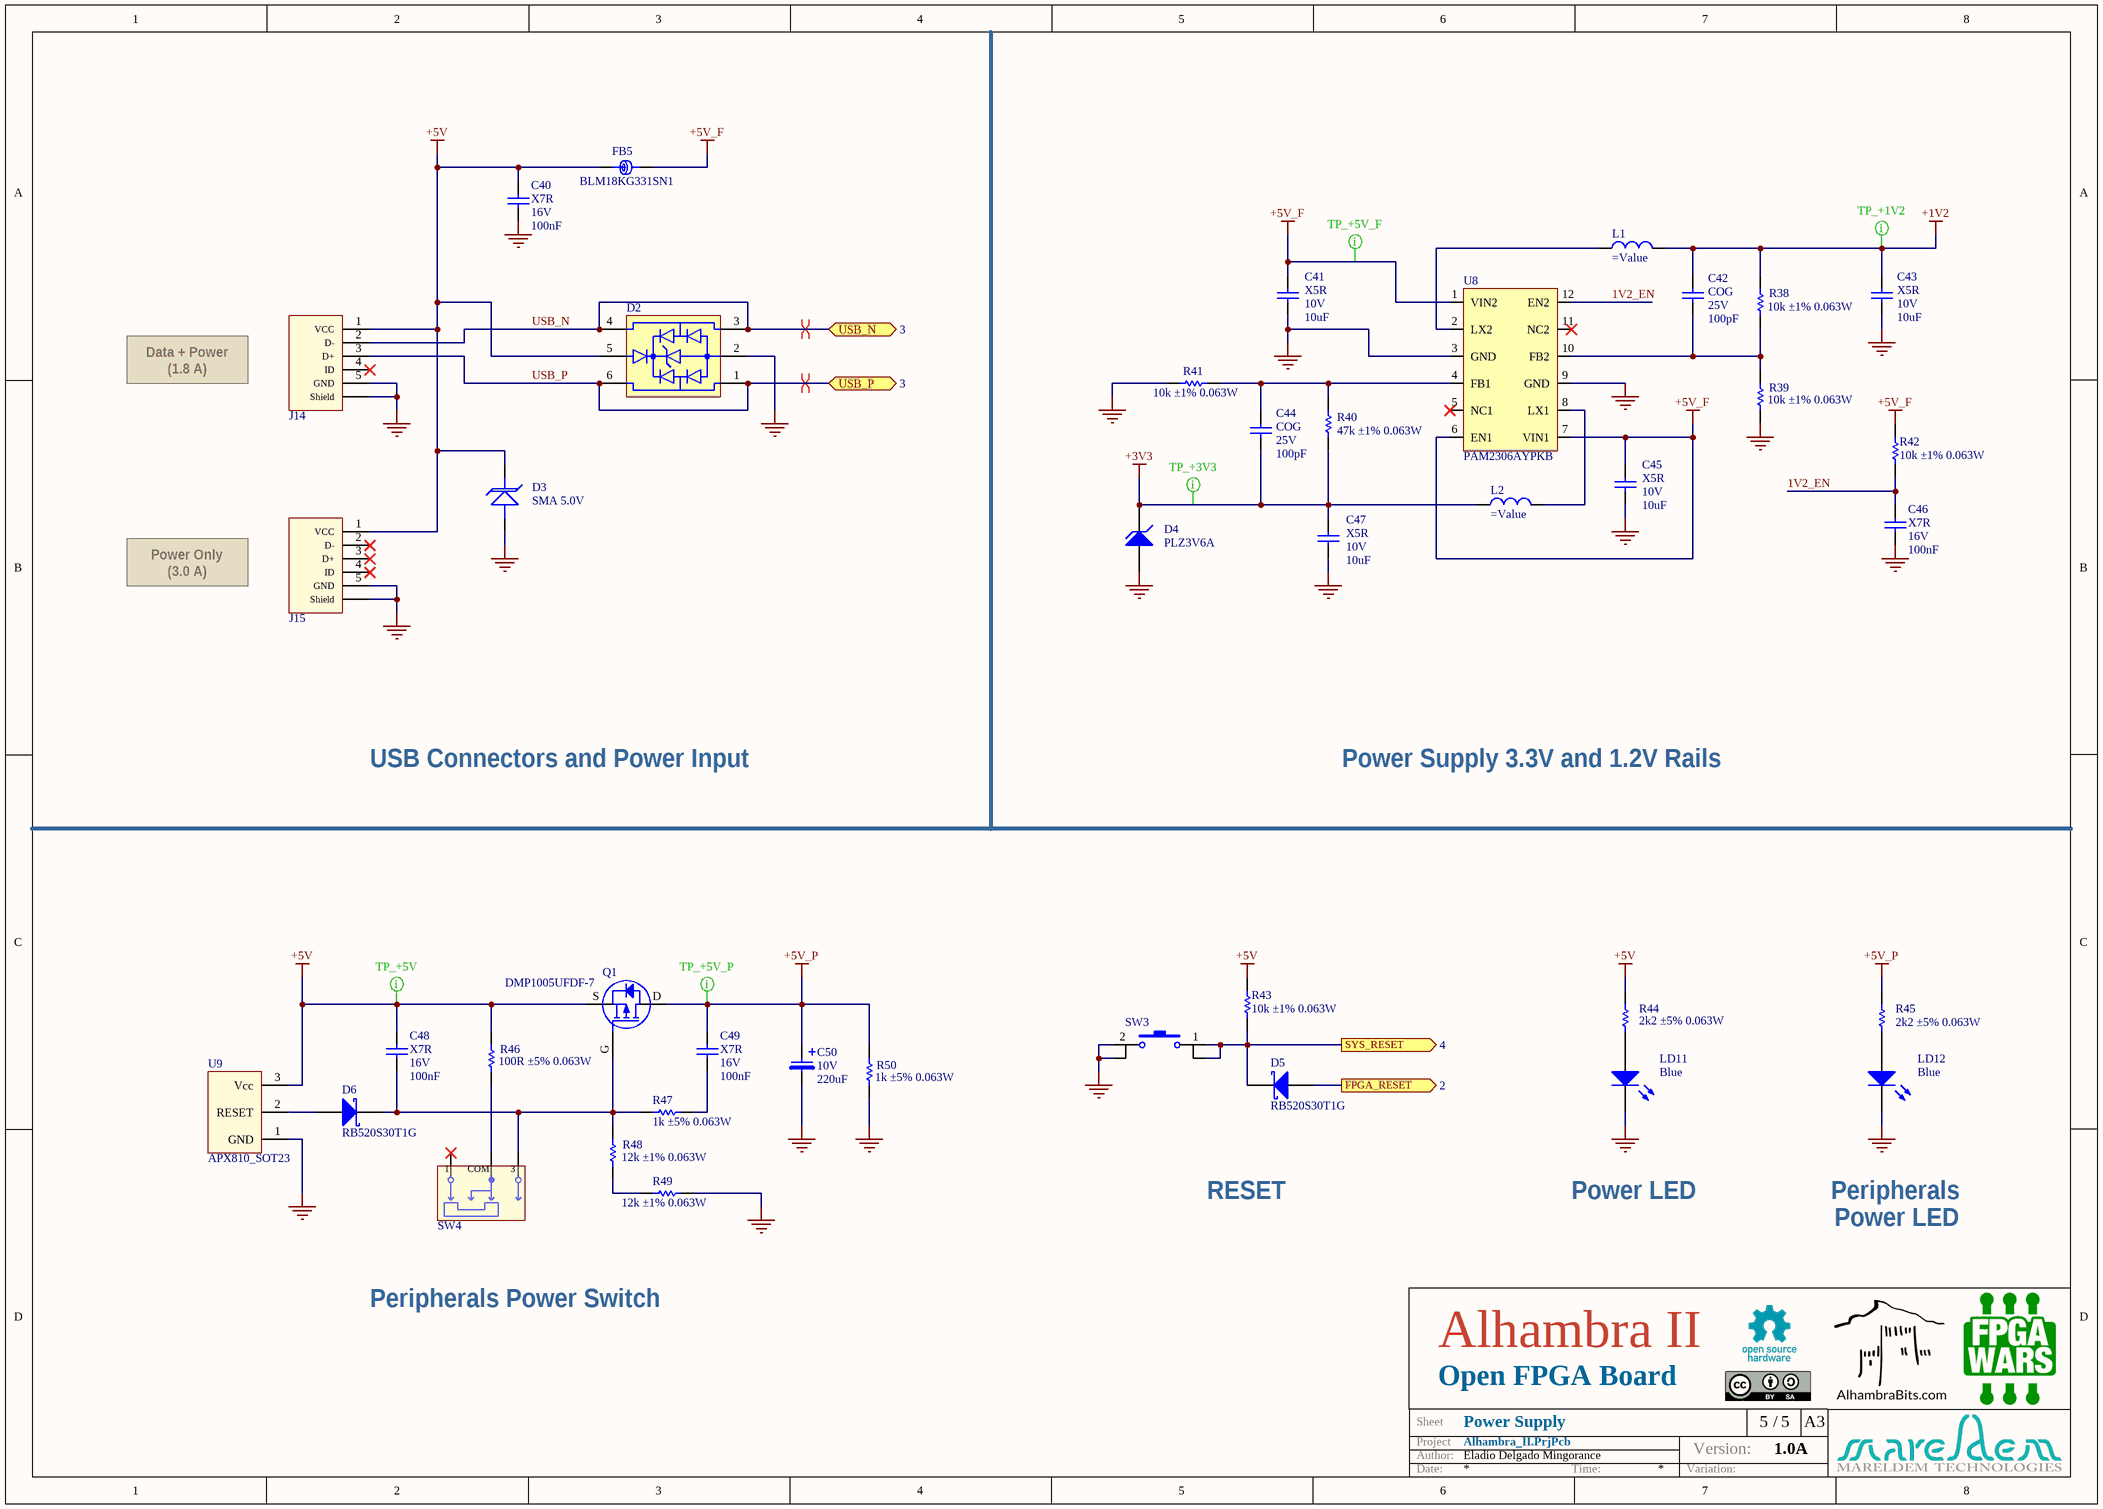
[diagram p4: [5]_Power_Supply.SchDoc]

### Parts
C40  Dielectric: X7R  Voltage: 16V  Capacitance: 100nF  [C0402]  (hidden comment: Capacitor)
C41  Dielectric: X5R  Voltage: 10V  Capacitance: 10uF  [C0805_1.25_HD]  (hidden comment: Capacitor)
C42  Dielectric: COG  Voltage: 25V  Capacitance: 100pF  [C0402]  (hidden comment: Capacitor)
C43  Dielectric: X5R  Voltage: 10V  Capacitance: 10uF  [C0603]  (hidden comment: Capacitor)
C44  Dielectric: COG  Voltage: 25V  Capacitance: 100pF  [C0402]  (hidden comment: Capacitor)
C45  Dielectric: X5R  Voltage: 10V  Capacitance: 10uF  [C0805_1.25_HD]  (hidden comment: Capacitor)
C46  Dielectric: X7R  Voltage: 16V  Capacitance: 100nF  [C0402]  (hidden comment: Capacitor)
C47  Dielectric: X5R  Voltage: 10V  Capacitance: 10uF  [C0805_1.25_HD]  (hidden comment: Capacitor)
C48  Dielectric: X7R  Voltage: 16V  Capacitance: 100nF  [C0402]  (hidden comment: Capacitor)
C49  Dielectric: X7R  Voltage: 16V  Capacitance: 100nF  [C0402]  (hidden comment: Capacitor)
C50  Voltage: 10V  Capacitance: 220uF  [C_POL_6.3x5.8_WE]  (hidden comment: Electrolytic)
D2  ESDUSB  [SOT563]  (value not drawn)
D3  SMA 5.0V  [DO-214AC-SMA_Unidir]
D4  PLZ3V6A  [DO-219AC]
D5  RB520S30T1G  [SOD523]
D6  RB520S30T1G  [SOD523]
FB5  BLM18KG331SN1  [L0603]
J14  629105136821  [629105136821]  (value not drawn)
J15  629105150521  [629105150521]  (value not drawn)
L1  (no value)  [4018_WE_LQS_4R7]
L2  (no value)  [4018_WE_LQS_4R7]
LD11  Blue  [LED0603]
LD12  Blue  [LED0603]
Q1  DMP1005UFDF-7  [U-DFN2020-6]
R38  value 10k ±1% 0.063W  [R0402]  (hidden comment: Resistor)
R39  value 10k ±1% 0.063W  [R0402]  (hidden comment: Resistor)
R40  value 47k ±1% 0.063W  [R0402]  (hidden comment: Resistor)
R41  value 10k ±1% 0.063W  [R0402]  (hidden comment: Resistor)
R42  value 10k ±1% 0.063W  [R0402]  (hidden comment: Resistor)
R43  value 10k ±1% 0.063W  [R0402]  (hidden comment: Resistor)
R44  value 2k2 ±5% 0.063W  [R0402]  (hidden comment: Resistor)
R45  value 2k2 ±5% 0.063W  [R0402]  (hidden comment: Resistor)
R46  value 100R ±5% 0.063W  [R0402]  (hidden comment: Resistor)
R47  value 1k ±5% 0.063W  [R0402]  (hidden comment: Resistor)
R48  value 12k ±1% 0.063W  [R0402]  (hidden comment: Resistor)
R49  value 12k ±1% 0.063W  [R0402]  (hidden comment: Resistor)
R50  value 1k ±5% 0.063W  [R0402]  (hidden comment: Resistor)
SW3  Switch_4P_SP_1-3_4-2  [4363x30458xx]  (value not drawn)
SW4  450404015514  [450404015514]  (value not drawn)
U8  PAM2306AYPKB  [WDFN_12_3x3]
U9  APX810_SOT23  [SOT23-3]

### Ports
FPGA_RESET (out, see 2), SYS_RESET (out, see 4), USB_N (bidir, see 3), USB_P (bidir, see 3)

### Nets
+1V2: C42.2 C43.2 L1.1 R38.2
+3V3: C44.1 C47.2 D4.k(K) L2.2 R40.1
+5V: C40.2 C48.2 D2.5 D3.K FB5.1 J14.1(VCC) J15.1(VCC) Q1.S R43.2 R44.2 R46.2 U9.3(Vcc)
+5V_F: C41.2 C45.2 FB5.2 R42.2 U8.1(VIN2) U8.6(EN1) U8.7(VIN1)
+5V_P: C49.2 C50.1 Q1.D R45.2 R50.2
GND: C40.1 C41.1 C43.1 C45.1 C46.1 C47.1 C50.2 D2.2 D3.A D4.A J14.5(GND) J14.Shell(Shield) J15.5(GND) J15.Shell(Shield) LD11.K LD12.K R39.1 R41.1 R49.2 R50.1 SW3.2 SW3.4 U8.3(GND) U8.9(GND) U9.1(GND)
1V2_EN: C46.2 R42.1 U8.12(EN2)
USB_N: D2.3 D2.4 J14.2(D-) ; port USB_N
USB_P: D2.1 D2.6 J14.3(D+) ; port USB_P
NetC42_1: C42.1 R38.1 R39.2 U8.10(FB2)
NetC44_2: C44.2 R40.2 R41.2 U8.4(FB1)
NetC48_1: C48.1 D6.k(K) Q1.G R47.1 R48.1 SW4.3
NetC49_1: C49.1 R47.2
NetD5_A: D5.A ; port FPGA_RESET
NetD5_k: D5.k(K) R43.1 SW3.1 SW3.3 ; port SYS_RESET
NetD6_A: D6.A U9.2(RESET)
NetL1_2: L1.2 U8.2(LX2)
NetL2_1: L2.1 U8.8(LX1)
NetLD11_A: LD11.A R44.1
NetLD12_A: LD12.A R45.1
NetR46_1: R46.1 SW4.2(COM)
NetR48_2: R48.2 R49.1

Not connected (* = marked no-connect by the designer): J14 4(ID)*; J15 2(D-)* 3(D+)* 4(ID)*; SW4 1*; U8 5(NC1)* 11(NC2)*

### Layout directives
net class Test Points: +1V2, +3V3, +5V, +5V_F, +5V_P
differential pair: USB_N, USB_P

### Notes on the sheet
- Data + Power
  (1.8 A)
- Power Only
  (3.0 A)
- USB Connectors and Power Input
- Power Supply 3.3V and 1.2V Rails
- RESET
- Power LED
- Peripherals
- Peripherals Power Switch
- Alhambra II
- Open FPGA Board
- Project
- Sheet
- Author:
- Version:
- /
- A3
- Date:
- Time:
- Variation:

### Library data of the parts
C40 C46 C48 C49 = C0402_100nF_16V_±10%: as C1 on sheet [2]_FPGA; Part Number: C0402_100nF_16V_±10%; Price (€): 0,05
C41 C45 C47 = C0805_1.25_HD_10uF_10V_X5R: Capacitor SMD; Manufacturer: Taiyo Yuden; Value: 10uF ±10% 10V; Tolerance: ±10%; OrderingCode: LMK212ABJ106KG; Temp_ Max: 85; Temp_ Min: -55; Part Number: C0805_1.25_HD_10uF_10V_X5R; Price (€): 0,03
C42 C44 = C0402_100pF_25V_±5%: Capacitor SMD; Manufacturer: WE; Value: 100pF ±5% 25V; Tolerance: ±5%; OrderingCode: 885012005046; Temp_ Max: 125; Temp_ Min: -55; Part Number: C0402_100pF_25V_±5%; Price (€): 0,007
C43 = C0603_10uF_10V_±10%: as C3 on sheet [2]_FPGA; Part Number: C0603_10uF_10V_±10%; Price (€): 0,027
C50 = Cap_Al_220uF_10V: Capacitor, Electrolytic, SMD; Manufacturer: WE; Value: 220uF 10V; OrderingCode: 875105244013; Temp_ Max: 105; Temp_ Min: -55; Part Number: Cap_Al_220uF_10V; Price (€): 0,3
D2 = USB ESD Single: Protection, USB ESD; Manufacturer: Würth; OrderingCode: 82400152; Temp_ Max: 125; Temp_ Min: -40; OrderingCode 2: CDSOT563-0502; Part Number: USB ESD Single; Supplier: Würth; Price (€): 0,1; Manufacturer 2: Bourns
D3 = TVS 5Vdc Unidir SMA: Protection, Transient Suppression Diode; Manufacturer: WE; Voltage: 5Vdc; Breakdown Voltage: 6,7Vdc; Overvoltage Current: 43,5A; OrderingCode: 824500500; Temp_ Max: 150; Temp_ Min: -65; Part Number: TVS 5Vdc Unidir SMA; Price (€): 0,108
D4 = PLZ3V6A: Zener Diode; Manufacturer: Vishay; Vzener: 3,6V; Tolerance: 0,025; Izener: 20mA; Power: 500mW; Temp_ Max: 150; Temp_ Min: -55; Value: 3,6V; Part Number: PLZ3V6A; OrderingCode: PLZ3V6A; Price (€): 0,07
D5 D6 = RB520S30T1G: as D1 on sheet [2]_FPGA; Part Number: RB520S30T1G; OrderingCode: RB520S30T1G; Price (€): 0,017
FB5 = L0603_330R_0,080R_1700 mA: as FB1 on sheet [3]_USB_Interface; Part Number: L0603_330R_0,080R_1700 mA; OrderingCode: BLM18KG331SN1; Price (€): 0,021
J14 = Micro USB 1.8A WE: Micro USB 2.0 SMT Type B Horizontal 5 Contacts WR-COM; Manufacturer: WE; Interface Type: Type B; Gender: Receptacle; Temp_ Max: 105; Temp_ Min: -40; ComponentLink1Description: Manufacturer; ComponentLink1URL: http://www.we-online.de; ComponentLink2Description: Datasheet; ComponentLink2URL: http://katalog.we-online.de/em/datasheet/629105136821.pdf; Part Number: Micro USB 1.8A WE; Published Date: April 2017; Publisher: Wurth Elektronik; Sub-Family: Micro USB 2.0; Type: Horizontal; Construction: SMT; OrderingCode: 629105136821; Supplier: WE; Price (€): 0,26
J15 = Micro USB 3.0A WE: Micro USB 2.0 SMT Type B Horizontal 5 Contacts High Current WR-COM; Manufacturer: WE; Interface Type: Type B; Gender: Receptacle; Temp_ Max: 85; Temp_ Min: -40; ComponentLink1Description: Manufacturer; ComponentLink1URL: http://www.we-online.de; ComponentLink2Description: Datasheet; ComponentLink2URL: http://katalog.we-online.de/em/datasheet/629105150521.pdf; Part Number: Micro USB 3.0A WE; Published Date: April 2017; Publisher: Wurth Elektronik; Sub-Family: Micro USB 2.0; Type: Horizontal; Construction: SMT; OrderingCode: 629105150521; Supplier: WE; Price (€): 0,58
L1 L2 = 4,7uH_1,7A_4018: Inductor SMD; Manufacturer: WE; L: 4,7uH; Rdc: 0,070R; Current: 1,7A; Current Sat#: 2,2A; OrderingCode: 74404042047; Temp_ Max: 125; Temp_ Min: -40; Value: 4,7uH 1,7A; Part Number: 4,7uH_1,7A_4018; Supplier: WE; Price (€): 0,128
LD11 LD12 = LED Blue 0603 Wurth: LED; Manufacturer: WE; OrderingCode: 150 060 BS7 5000; Temp_ Max: 85; Temp_ Min: -40; Part Number: LED Blue 0603 Wurth; Price (€): 0,09; Value: Blue
Q1 = DMP1005UFDF: P-Channel MOSFET; Manufacturer: Diodes Incorporated; Vds: 12V; Vgss: 8V; Id: 26A; Temp_ Max: 150; Temp_ Min: -55; Part Number: DMP1005UFDF; OrderingCode: DMP1005UFDF-7; Price (€): 0,16
R38 R39 R41-R43 = R0402_10k_0.063W_±1%: as R1 on sheet [2]_FPGA; PackageDescription: SMD; Part Number: R0402_10k_0.063W_±1%; Price (€): 0,006
R40 = R0402_47k_0.063W_±1%: Resistor, SMD; Manufacturer: Vishay; Tolerance: ±1%; OrderingCode: CRCW040247K0FK; Power: 0.063W; Resistance: 47k; Temp_ Max: 155; Temp_ Min: -55; PackageDescription: SMD; Part Number: R0402_47k_0.063W_±1%; Price (€): 0,006
R44 R45 = R0402_2k2_0.063W_±5%: as R18 on sheet [2]_FPGA; PackageDescription: SMD; Part Number: R0402_2k2_0.063W_±5%; Price (€): 0,003
R46 = R0402_100R_0.063W_±5%: as R16 on sheet [2]_FPGA; PackageDescription: SMD; Part Number: R0402_100R_0.063W_±5%; Price (€): 0,003
R47 R50 = R0402_22k_0.063W_±5%: Resistor, SMD; Part Number: R0402_1k_0.063W_±5%; Manufacturer: Vishay; Tolerance: ±5%; OrderingCode: CRCW04021K00JN; Power: 0.063W; Resistance: 1k; Temp_ Max: 155; Temp_ Min: -55; PackageDescription: SMD; Price (€): 0,003
R48 R49 = R0402_12k_0.063W_±1%: as R24 on sheet [3]_USB_Interface; PackageDescription: SMD; Part Number: R0402_12k_0.063W_±1%; Price (€): 0,006
SW3 = SW 4,7x3,5 mm SMD side push: as SW1 on sheet [4]_Connectors_&_IO; Part Number: SW 4,7x3,5 mm SMD side push; Supplier: WE; Price (€): 0,2
SW4 = RA Slide Switch: WS-SLSU 6.7x2.7 mm SMD Right Angled, boss design; Manufacturer: WE; Temp_ Max: 85; Temp_ Min: -40; ComponentLink1Description: Manufacturer; ComponentLink1URL: http://www.we-online.de; ComponentLink2Description: Datasheet; ComponentLink2URL: http://katalog.we-online.de/em/datasheet/450404015514.pdf; Part Number: RA Slide Switch; Published Date: March 2017; Publisher: Wurth Elektronik; OrderingCode: 450404015514; Supplier: WE; Price (€): 0,27
U8 = PAM2360: Dual Step-Down DC/DC converter 1A, 1.5 MHz; Manufacturer: Diodes; Voltage IN: 2.5 a 5.5 VDC; Voltage OUT: 1,2 a 3,3 VDC; Current OUT: 1A + 1A; Temp_ Max: 85; Temp_ Min: -40; OrderingCode 2: PAM2306AYPAA; Part Number: PAM2360; OrderingCode: PAM2306AYPKB; Supplier: RS; Price (€): 0,32
U9 = APX810: Voltage supervisor, Reset active high, 200ms; Part Number: APX810; Manufacturer: Diodes Incorporated; OrderingCode: APX810-29SAG-7; Temp_ Max: 105; Temp_ Min: -40; Value: 2,93V; Supplier: Silica; Price (€): 0,1

## Nets that join several sheets
+1V2: [2]_FPGA (10 pins), [5]_Power_Supply (C42.2 C43.2 L1.1 R38.2)
+3V3: [2]_FPGA (28 pins), [3]_USB_Interface (24 pins), [4]_Connectors_&_IO (9 pins), [5]_Power_Supply (5 pins)
+5V: [4]_Connectors_&_IO (FB4.2), [5]_Power_Supply (12 pins)
+5V_P: [4]_Connectors_&_IO (21 pins), [5]_Power_Supply (5 pins)
GND: [2]_FPGA (24 pins), [3]_USB_Interface (28 pins), [4]_Connectors_&_IO (44 pins), [5]_Power_Supply (25 pins)
A0: [2]_FPGA (R12.1), [4]_Connectors_&_IO (J6.1 J7.1 R30.4)
A1: [2]_FPGA (R12.2), [4]_Connectors_&_IO (J6.2 J7.2 R30.3)
A2: [2]_FPGA (R12.3), [4]_Connectors_&_IO (J6.3 J7.3 R30.2)
A3: [2]_FPGA (R12.4), [4]_Connectors_&_IO (J6.4 J7.4 R30.1)
D0: [2]_FPGA (R5.5), [4]_Connectors_&_IO (J4.1 J5.1)
D1: [2]_FPGA (R5.6), [4]_Connectors_&_IO (J4.2 J5.2)
D2: [2]_FPGA (R5.7), [4]_Connectors_&_IO (J4.3 J5.3)
D3: [2]_FPGA (R5.8), [4]_Connectors_&_IO (J4.4 J5.4)
D4: [2]_FPGA (R7.5), [4]_Connectors_&_IO (J4.5 J5.5)
D5: [2]_FPGA (R7.6), [4]_Connectors_&_IO (J4.6 J5.6)
D6: [2]_FPGA (R7.7), [4]_Connectors_&_IO (J4.7 J5.7)
D7: [2]_FPGA (R7.8), [4]_Connectors_&_IO (J4.8 J5.8)
D8: [2]_FPGA (R9.5), [4]_Connectors_&_IO (J1.1 J3.1)
D9: [2]_FPGA (R9.6), [4]_Connectors_&_IO (J1.2 J3.2)
D10: [2]_FPGA (R9.7), [4]_Connectors_&_IO (J1.3 J3.3)
D11: [2]_FPGA (R9.8), [4]_Connectors_&_IO (J1.4 J3.4)
D12: [2]_FPGA (R10.6), [4]_Connectors_&_IO (J1.5 J3.5)
D13: [2]_FPGA (R10.8), [4]_Connectors_&_IO (J1.6 J3.6)
DD4_SDA: [2]_FPGA (R13.1), [4]_Connectors_&_IO (J6.5 J7.5 R32.1)
DD5_SCL: [2]_FPGA (R13.4), [4]_Connectors_&_IO (J6.6 J7.6 R31.1)
NetC38_2: [2]_FPGA (U1.34), [4]_Connectors_&_IO (C38.2 R36.2 SW1.1 SW1.3)
NetC39_2: [2]_FPGA (U1.33), [4]_Connectors_&_IO (C39.2 R37.2 SW2.1 SW2.3)
NetD5_A: [2]_FPGA (R2.2 R3.2 U1.66), [5]_Power_Supply (D5.A)
NetD5_k: [4]_Connectors_&_IO (J2.1), [5]_Power_Supply (D5.k R43.1 SW3.1 SW3.3)
NetR1_2: [2]_FPGA (R1.2 U1.65), [3]_USB_Interface (U3.23)
NetR3_1: [2]_FPGA (R3.1), [3]_USB_Interface (U3.24)
NetR15_1: [2]_FPGA (R15.1), [3]_USB_Interface (U3.18)
NetR15_2: [2]_FPGA (R15.2), [3]_USB_Interface (U3.17)
NetR15_3: [2]_FPGA (R15.3), [3]_USB_Interface (U3.16)
NetR15_4: [2]_FPGA (R15.4), [3]_USB_Interface (U3.21)
NetR27_2: [2]_FPGA (U1.49), [3]_USB_Interface (R27.2)
NetR28_1: [2]_FPGA (U1.84), [4]_Connectors_&_IO (R28.1 U7.3)
NetR29_1: [2]_FPGA (U1.83), [4]_Connectors_&_IO (R29.1 U7.4)
NetR34_1: [2]_FPGA (U1.41), [4]_Connectors_&_IO (R34.1)
NetR34_2: [2]_FPGA (U1.39), [4]_Connectors_&_IO (R34.2)
NetR34_3: [2]_FPGA (U1.38), [4]_Connectors_&_IO (R34.3)
NetR34_4: [2]_FPGA (U1.37), [4]_Connectors_&_IO (R34.4)
NetR35_1: [2]_FPGA (U1.45), [4]_Connectors_&_IO (R35.1)
NetR35_2: [2]_FPGA (U1.44), [4]_Connectors_&_IO (R35.2)
NetR35_3: [2]_FPGA (U1.43), [4]_Connectors_&_IO (R35.3)
NetR35_4: [2]_FPGA (U1.42), [4]_Connectors_&_IO (R35.4)
NetU1_47: [2]_FPGA (U1.47), [3]_USB_Interface (U3.45)
NetU1_48: [2]_FPGA (U1.48), [3]_USB_Interface (U3.44)
NetU1_52: [2]_FPGA (U1.52), [3]_USB_Interface (U3.43)
NetU1_56: [2]_FPGA (U1.56), [3]_USB_Interface (U3.41)
NetU1_60: [2]_FPGA (U1.60), [3]_USB_Interface (U3.40)
NetU1_61: [2]_FPGA (U1.61), [3]_USB_Interface (U3.39)
NetU1_62: [2]_FPGA (U1.62), [3]_USB_Interface (U3.38)
NetU1_90: [2]_FPGA (U1.90), [4]_Connectors_&_IO (U7.2)
USB_N: [3]_USB_Interface (U3.7), [5]_Power_Supply (D2.3 D2.4 J14.2)
USB_P: [3]_USB_Interface (U3.8), [5]_Power_Supply (D2.1 D2.6 J14.3)